# Altium project PS_PWR_UNIT.PrjPcb
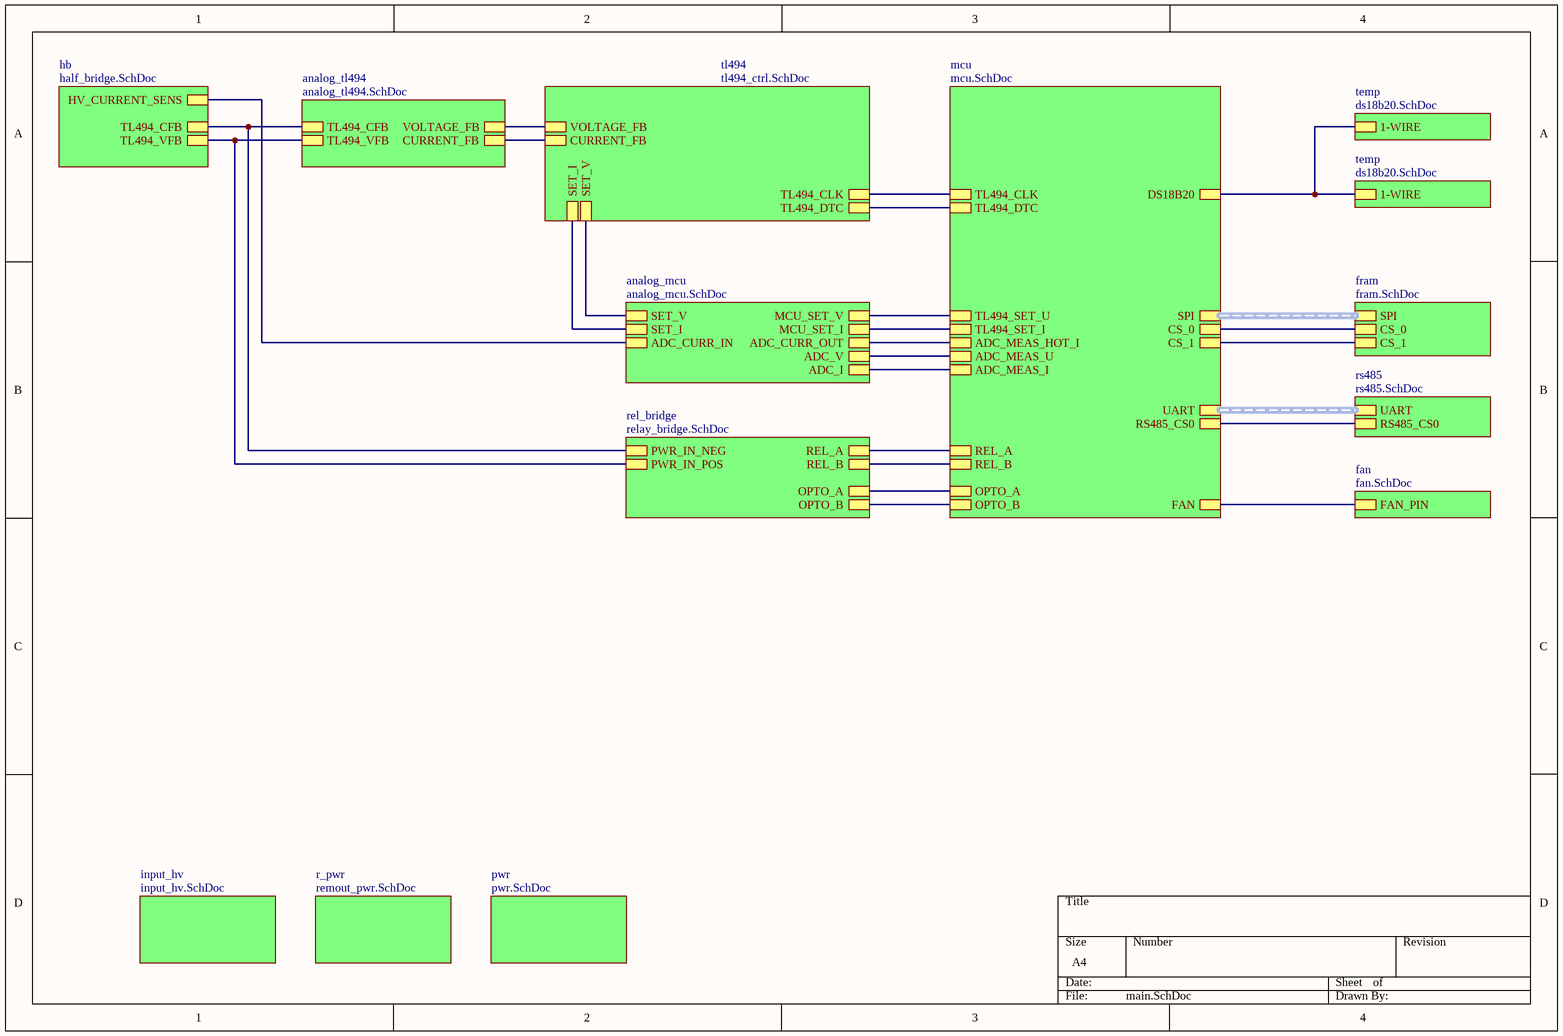
[diagram p0: main.SchDoc]
14 sheets, 287 parts. Net scope: hierarchical (ports join the sheet entries above them; power ports are global).
Board file: pwr_unit_v1.0.PcbDoc
Sheets:
  main.SchDoc
    mcu = mcu.SchDoc
    input_hv = input_hv.SchDoc
    hb = half_bridge.SchDoc
    tl494 = tl494_ctrl.SchDoc
    pwr = pwr.SchDoc
    r_pwr = remout_pwr.SchDoc
    fram = fram.SchDoc
    fan = fan.SchDoc
    rel_bridge = relay_bridge.SchDoc
    analog_tl494 = analog_tl494.SchDoc
    analog_mcu = analog_mcu.SchDoc
    rs485 = rs485.SchDoc
    temp = ds18b20.SchDoc
    temp = ds18b20.SchDoc

## Sheet main.SchDoc
size A4; SheetNumber: 1; SheetTotal: 14

### Sub-sheets
analog_mcu = analog_mcu.SchDoc: MCU_SET_V, MCU_SET_I, SET_V, SET_I, ADC_I, ADC_V, ADC_CURR_OUT, ADC_CURR_IN
analog_tl494 = analog_tl494.SchDoc: TL494_CFB, CURRENT_FB, VOLTAGE_FB, TL494_VFB
fan = fan.SchDoc: FAN_PIN
fram = fram.SchDoc: SPI (harness SPI), CS_0, CS_1
hb = half_bridge.SchDoc: TL494_VFB, TL494_CFB, HV_CURRENT_SENS
input_hv = input_hv.SchDoc: no entries
mcu = mcu.SchDoc: CS_0, CS_1, REL_B, FAN, OPTO_B, TL494_SET_U, DS18B20, SPI (harness SPI), OPTO_A, TL494_CLK, TL494_DTC, ADC_MEAS_HOT_I, RS485_CS0, REL_A, TL494_SET_I, UART (harness UART), ADC_MEAS_U, ADC_MEAS_I
pwr = pwr.SchDoc: no entries
r_pwr = remout_pwr.SchDoc: no entries
rel_bridge = relay_bridge.SchDoc: PWR_IN_NEG, PWR_IN_POS, OPTO_A, OPTO_B, REL_A, REL_B
rs485 = rs485.SchDoc: UART (harness UART), RS485_CS0
temp = ds18b20.SchDoc: 1-WIRE
temp = ds18b20.SchDoc: 1-WIRE
tl494 = tl494_ctrl.SchDoc: VOLTAGE_FB, TL494_DTC, TL494_CLK, CURRENT_FB, SET_I, SET_V

### Nets
CS: sheet mcu/RS485_CS0, sheet rs485/RS485_CS0
CS0: sheet mcu/CS_0, sheet fram/CS_0
CS1: sheet mcu/CS_1, sheet fram/CS_1
CurrentSensOut: sheet hb/HV_CURRENT_SENS, sheet analog_mcu/ADC_CURR_IN
PA0: sheet mcu/ADC_MEAS_U, sheet analog_mcu/ADC_V
PA1: sheet mcu/ADC_MEAS_I, sheet analog_mcu/ADC_I
PA2: sheet mcu/ADC_MEAS_HOT_I, sheet analog_mcu/ADC_CURR_OUT
PA6: sheet mcu/TL494_SET_I, sheet analog_mcu/MCU_SET_I
PA7: sheet mcu/TL494_SET_U, sheet analog_mcu/MCU_SET_V
PA10: sheet mcu/REL_A, sheet rel_bridge/REL_A
PA11: sheet mcu/OPTO_B, sheet rel_bridge/OPTO_B
PA12: sheet mcu/OPTO_A, sheet rel_bridge/OPTO_A
PB6: sheet mcu/DS18B20, sheet temp/1-WIRE, sheet temp/1-WIRE
PB13: sheet mcu/TL494_CLK, sheet tl494/TL494_CLK
PB14: sheet mcu/TL494_DTC, sheet tl494/TL494_DTC
PB15: sheet mcu/FAN, sheet fan/FAN_PIN
PC7: sheet mcu/REL_B, sheet rel_bridge/REL_B
TL494_CURRENT_FB: sheet hb/TL494_CFB, sheet rel_bridge/PWR_IN_NEG, sheet analog_tl494/TL494_CFB
NetC18_1: sheet hb/TL494_VFB, sheet rel_bridge/PWR_IN_POS, sheet analog_tl494/TL494_VFB
NetC52_1: sheet tl494/SET_I, sheet analog_mcu/SET_I
NetC57_1: sheet tl494/SET_V, sheet analog_mcu/SET_V
NetR77_2: sheet tl494/VOLTAGE_FB, sheet analog_tl494/VOLTAGE_FB
NetR81_2: sheet tl494/CURRENT_FB, sheet analog_tl494/CURRENT_FB

### Buses and harness runs
harness sheet fram/SPI = sheet mcu/SPI
harness sheet mcu/UART = sheet rs485/UART

## Sheet mcu.SchDoc
size A4; SheetNumber: 9; SheetTotal: 14
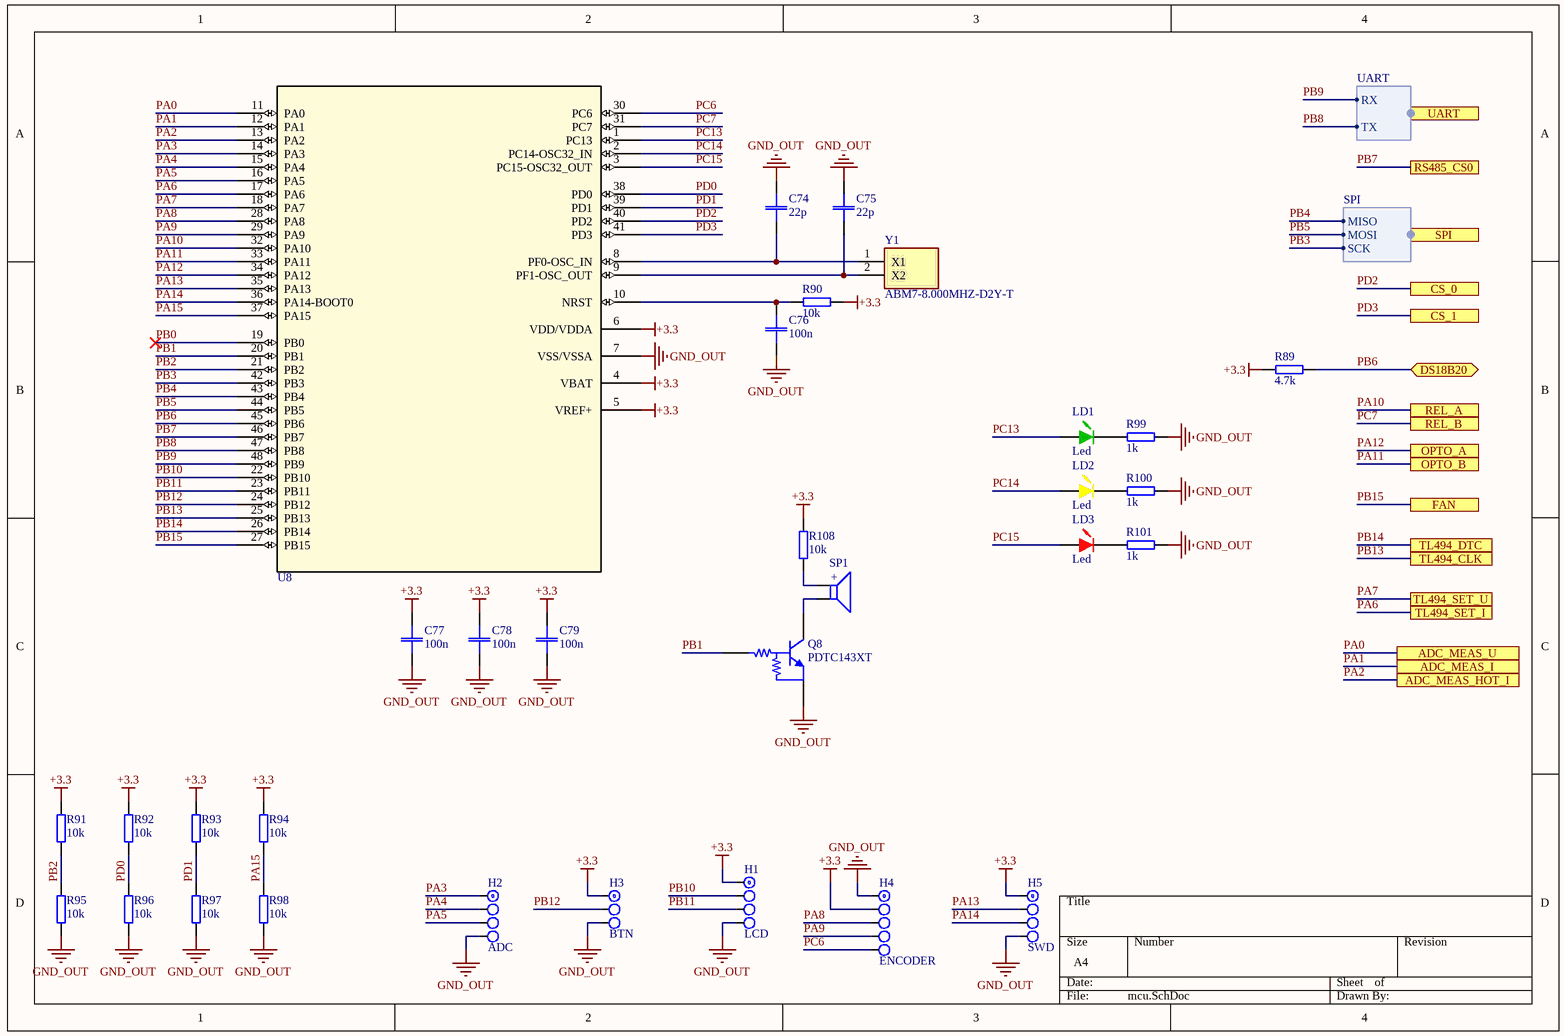
[diagram p1: mcu.SchDoc]

### Parts
C74  22p  [CAP: 0603]
C75  22p  [CAP: 0603]
C76  100n  [CAP: 0603]
C77  100n  [CAP: 0603]
C78  100n  [CAP: 0603]
C79  100n  [CAP: 0603]
H1  LCD  [J1x4]
H2  ADC  [J1x4]
H3  BTN  [J1x3]
H4  ENCODER  [J1x5]
H5  SWD  [J1x4]
LD1  Led  [Led 0805-Green]
LD2  Led  [Led 0805-Yellow]
LD3  Led  [Led 0805-Red]
Q8  PDTC143XT  [SOT23_N]
R89  4.7k  [RES: 0603]
R90  10k  [RES: 0603]
R91  10k  [RES: 0603]
R92  10k  [RES: 0603]
R93  10k  [RES: 0603]
R94  10k  [RES: 0603]
R95  10k  [RES: 0603]
R96  10k  [RES: 0603]
R97  10k  [RES: 0603]
R98  10k  [RES: 0603]
R99  1k  [RES: 0603]
R100  1k  [RES: 0603]
R101  1k  [RES: 0603]
R108  10k  [RES: 0603]
SP1  (no value)  [BUZ: D12mm  P7.6mm]
U8  STM32G070CBTx  [48-LQFP]  (value not drawn)
Y1  ABM7-8.000MHZ-D2Y-T  [ABM78000MHZD2YT]

### Ports
ADC_MEAS_HOT_I, ADC_MEAS_I, ADC_MEAS_U, CS_0, CS_1, DS18B20 (bidir), FAN, OPTO_A, OPTO_B, REL_A, REL_B, RS485_CS0, SPI (harness SPI), TL494_CLK, TL494_DTC, TL494_SET_I, TL494_SET_U, UART (harness UART)

### Harnesses
UART: RX, TX
SPI: MISO, SCK, MOSI

### Nets
+3.3: C77.2 C78.2 C79.2 H1.1 H3.1 H4.2 H5.1 R89.1 R90.2 R91.1 R92.1 R93.1 R94.1 R108.1 U8.4(VBAT) U8.5(VREF+) U8.6(VDD/VDDA)
GND_OUT: C74.2 C75.2 C76.1 C77.1 C78.1 C79.1 H1.4 H2.4 H3.3 H4.1 H5.4 Q8.2(E) R95.2 R96.2 R97.2 R98.2 R99.2 R100.2 R101.2 U8.7(VSS/VSSA)
PA0: U8.11(PA0) ; port ADC_MEAS_U
PA1: U8.12(PA1) ; port ADC_MEAS_I
PA2: U8.13(PA2) ; port ADC_MEAS_HOT_I
PA3: H2.1 U8.14(PA3)
PA4: H2.2 U8.15(PA4)
PA5: H2.3 U8.16(PA5)
PA6: U8.17(PA6) ; port TL494_SET_I
PA7: U8.18(PA7) ; port TL494_SET_U
PA8: H4.3 U8.28(PA8)
PA9: H4.4 U8.29(PA9)
PA10: U8.32(PA10) ; port REL_A
PA11: U8.33(PA11) ; port OPTO_B
PA12: U8.34(PA12) ; port OPTO_A
PA13: H5.2 U8.35(PA13)
PA14: H5.3 U8.36(PA14-BOOT0)
PA15: R94.2 R98.1 U8.37(PA15)
PB0: U8.19(PB0)
PB1: Q8.1(B) U8.20(PB1)
PB2: R91.2 R95.1 U8.21(PB2)
PB3: U8.42(PB3) ; port SPI.SCK  [project net CLK]
PB4: U8.43(PB4) ; port SPI.MISO  [project net MISO]
PB5: U8.44(PB5) ; port SPI.MOSI  [project net MOSI]
PB6: R89.2 U8.45(PB6) ; port DS18B20
PB7: U8.46(PB7) ; port RS485_CS0  [project net CS]
PB8: U8.47(PB8) ; port UART.TX
PB9: U8.48(PB9) ; port UART.RX
PB10: H1.2 U8.22(PB10)
PB11: H1.3 U8.23(PB11)
PB12: H3.2 U8.24(PB12)
PB13: U8.25(PB13) ; port TL494_CLK
PB14: U8.26(PB14) ; port TL494_DTC
PB15: U8.27(PB15) ; port FAN
PC6: H4.5 U8.30(PC6)
PC7: U8.31(PC7) ; port REL_B
PC13: LD1.1(A) U8.1(PC13)
PC14: LD2.1(A) U8.2(PC14-OSC32_IN)
PC15: LD3.1(A) U8.3(PC15-OSC32_OUT)
PD0: R92.2 R96.1 U8.38(PD0)
PD1: R93.2 R97.1 U8.39(PD1)
PD2: U8.40(PD2) ; port CS_0  [project net CS0]
PD3: U8.41(PD3) ; port CS_1  [project net CS1]
NetC74_1: C74.1 U8.8(PF0-OSC_IN) Y1.1(X1)
NetC75_1: C75.1 U8.9(PF1-OSC_OUT) Y1.2(X2)
NetC76_2: C76.2 R90.1 U8.10(NRST)
NetLD1_2: LD1.2(K) R99.1
NetLD2_2: LD2.2(K) R100.1
NetLD3_2: LD3.2(K) R101.1
NetQ8_3: Q8.3(C) SP1.2
NetR108_2: R108.2 SP1.1

### Notes on the sheet
- (in symbol BUZZER) +

### Library data of the parts
C74-C79 = C_SMD
  C74 C75: Value: 22p
  C76-C79: Value: 100n
H1 H2 H5 = H-1x4: Price: 0.04
H3 = H-1x3: Price: 0.03
H4 = H-1x5: Price: 0.05
LD1 = Led 0805 KP-2012SGC: Green 565nm 15mcd; Price: 0.09
LD2 = Led 0805 KP-2012YC: Yellow 590nm 8mcd; Price: 0.09
LD3 = Led 0805 KP-2012EC: Red  627nm 12mcd; Price: 0.09
Q8 = PDTC143XT: NPN Resistor-equipped Transistor; Published: 17-Sep-2003; LatestRevisionDate: 12-Dec-2006; LatestRevisionNote: IPC-7351 Footprint Added.; DatasheetVersion: 20-Apr-1999; PackageVersion: May-1999; PackageReference: SOT23; Publisher: Altium Limited; PackageDescription: 3-Pin SOT-23 Package 0.95 mm Pitch, 2.3 mm Lead Span; ComponentLink1Description: Manufacturer Link; ComponentLink1URL: http://www.semiconductors.philips.com/; ComponentLink2Description: Datasheet; ComponentLink2URL: http://www.semiconductors.philips.com/acrobat/datasheets/PDTC143X_SERIES_8.pdf
R89-R101 R108 = R_SMD
  R89: Value: 4.7k
  R90-R98 R108: Value: 10k
  R99-R101: Value: 1k
SP1 = BUZZER
U8 = STM32G070CBTx: The STM32G070CB/KB/RB mainstream microcontrollers are based on high-performance Arm® Cortex®-M0+ 32-bit RISC core operating at up to 64 MHz frequency. / 128 Kbytes of Flash program memory and 36 Kbytes of SRAM. With 48pin LQFP 7x7x1.4 package; Manufacturer_Part_Number: stm32g0_lqfp48_t2; Vendor: STMicroelectronics; Copyright: Copyright (C) 2018 Accelerated Designs. All rights reserved; RefDes: RefDes; Type: DEV; Value: Value
Y1 = ABM7-8.000MHZ-D2Y-T: Crystal or Oscillator; Manufacturer_Name: ABRACON; Datasheet Link: http://www.abracon.com/Resonators/abm7.pdf; Height: 1.4mm; Manufacturer_Part_Number: ABM7-8.000MHZ-D2Y-T; Mouser Part Number: 815-ABM7-8-D2Y-T; Mouser Price/Stock: https://www.mouser.co.uk/ProductDetail/ABRACON/ABM7-8000MHZ-D2Y-T?qs=LoTOQoUkC8SFsmY8snleBA%3D%3D; Arrow Part Number: ABM7-8.000MHZ-D2Y-T; Arrow Price/Stock: https://www.arrow.com/en/products/abm7-8.000mhz-d2y-t/abracon?region=nac

## Sheet input_hv.SchDoc
size A4; SheetNumber: 2; SheetTotal: 14
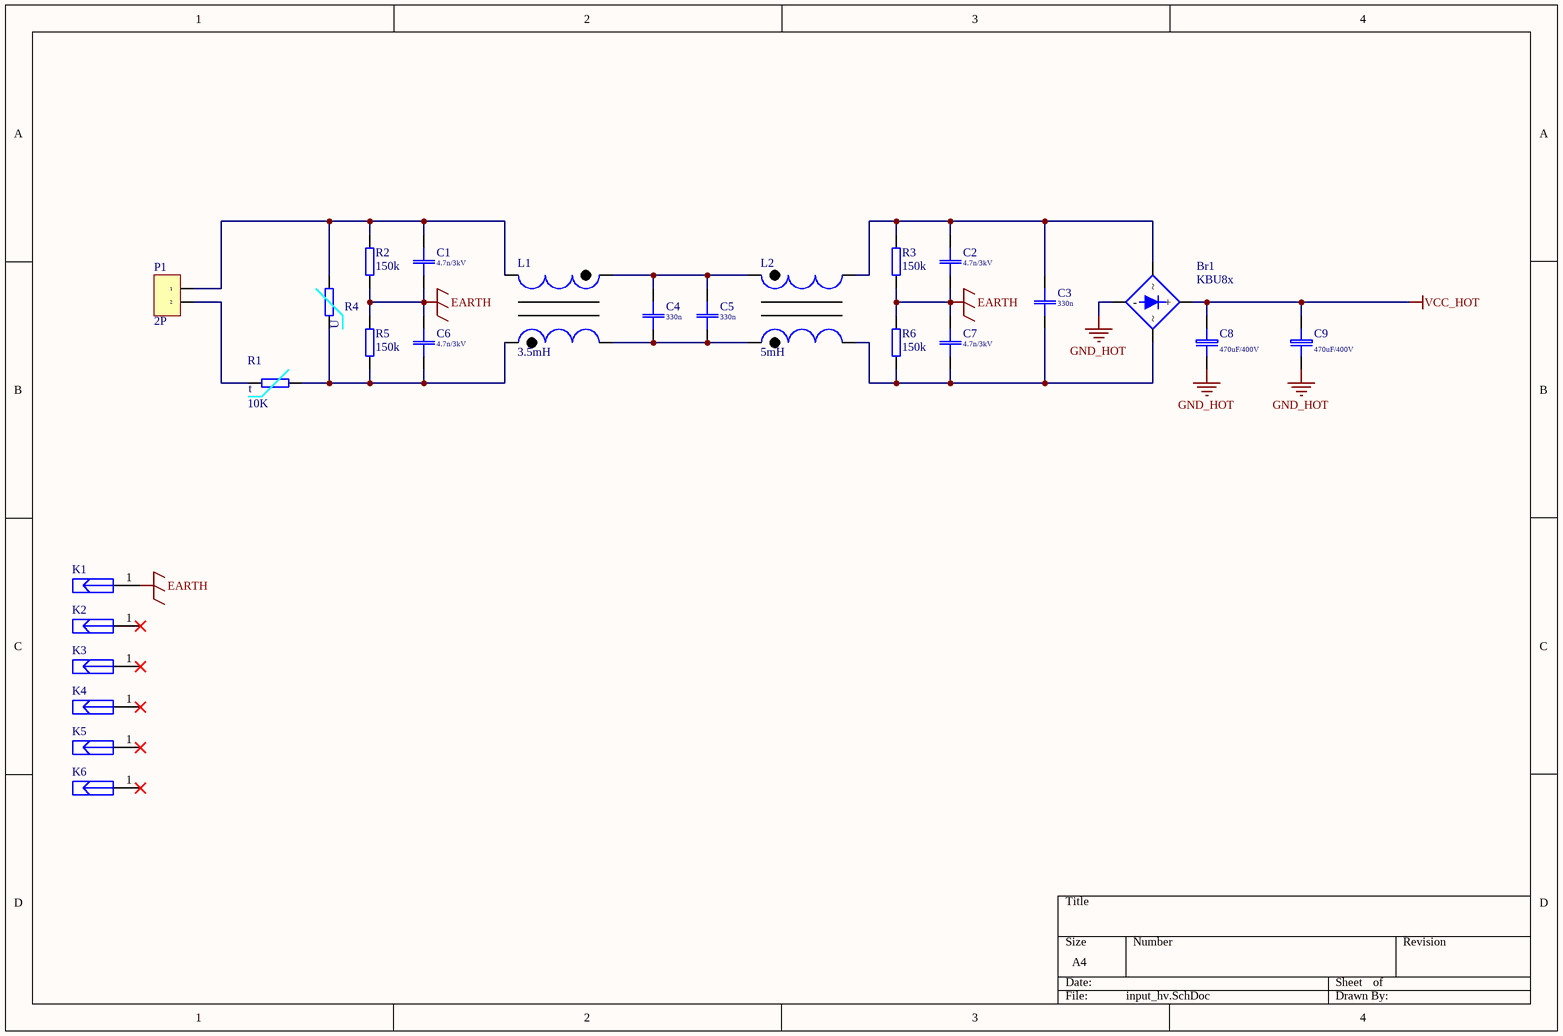
[diagram p2: input_hv.SchDoc]

### Parts
Br1  KBU8x  [KBU-200 h22mm]
C1  4.7n/3kV  [Cer-Disk-D8-R7.62]
C2  4.7n/3kV  [Cer-Disk-D8-R7.62]
C3  330n  [MKP X2 100nF 275V AC]
C4  330n  [MKP X2 100nF 275V AC]
C5  330n  [MKP X2 100nF 275V AC]
C6  4.7n/3kV  [Cer-Disk-D8-R7.62]
C7  4.7n/3kV  [Cer-Disk-D8-R7.62]
C8  470uF/400V  [CAP: D25C10H50]
C9  470uF/400V  [CAP: D25C10H50]
K1  (no value)  [CON: TH 3.5mm]
K2  (no value)  [CON: TH 3.5mm]
K3  (no value)  [CON: TH 3.5mm]
K4  (no value)  [CON: TH 3.5mm]
K5  (no value)  [CON: TH 3.5mm]
K6  (no value)  [CON: TH 3.5mm]
L1  3.5mH  [IND: R26.9/14.7/11.2 (H)]
L2  5mH  [IND: R26.9/14.7/11.2 (H)]
P1  2P  [CON: 2P V 3.5mm]
R1  10K  [RES: NTC D15-R7.62]
R2  150k  [RES: 0.125W H]
R3  150k  [RES: 0.125W H]
R4  VAR  [RES: VAR 11K 300]  (value not drawn)
R5  150k  [RES: 0.125W H]
R6  150k  [RES: 0.125W H]

### Nets
EARTH: C1.2 C2.2 C6.1 C7.1 K1.1 R2.2 R3.2 R5.1 R6.1
GND_HOT: Br1.2(-) C8.2(-) C9.2(-)
VCC_HOT: Br1.1(+) C8.1(+) C9.1(+)
NetBr1_3: Br1.3 C3.2 C7.2 L2.4 R6.2
NetBr1_4: Br1.4 C2.1 C3.1 L2.2 R3.1
NetC1_1: C1.1 L1.1 P1.1 R2.1 R4.2
NetC4_1: C4.1 C5.1 L1.2 L2.1
NetC4_2: C4.2 C5.2 L1.4 L2.3
NetC6_2: C6.2 L1.3 R1.2 R4.1 R5.2
NetP1_2: P1.2 R1.1

Not connected (* = marked no-connect by the designer): K2 1*; K3 1*; K4 1*; K5 1*; K6 1*

### Notes on the sheet
- (in symbol R_NTC) t
- (in symbol R_VAR) U

### Library data of the parts
Br1 = KBU: Грец  8A; Price: 0.52
C1 C2 C6 C7 = Cer Disc HV 2.2n 2kV: 2.2n 2kV Y5P; Tip: Suntan TS16 2.2nF 2kV Y5P; Price: 0.072; Value: 4.7n/3kV
C3-C5 = X2 100n 275V AC: X2 250V AC; Price: 0.15; Value: 330n
C8 C9 = C_EL: Value: 470uF/400V
K1-K6 = PCB CON
L1 = DROSSEL_1: Value: 3.5mH
L2 = DROSSEL: Value: 5mH
R1 = R_NTC: Value: 10K
R2 R3 R5 R6 = R_DIP: Value: 150k
R4 = R_VAR: Value: VAR
P1 = 2P: Value: 2P

## Sheet half_bridge.SchDoc
size A4; SheetNumber: 3; SheetTotal: 14
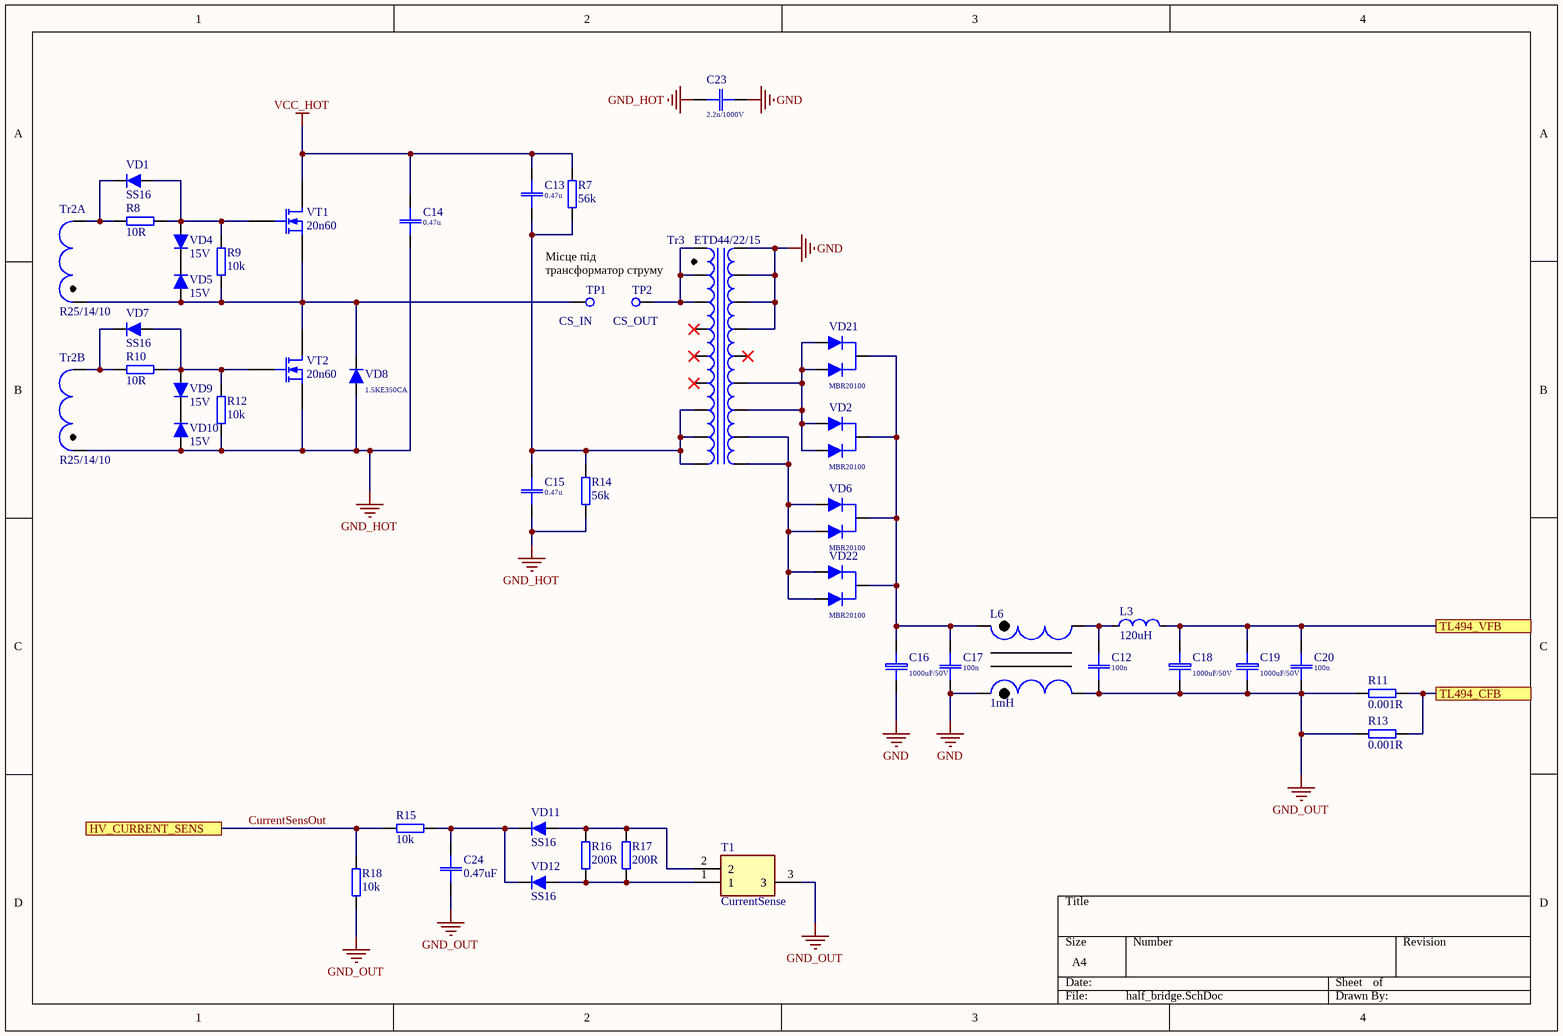
[diagram p3: half_bridge.SchDoc]

### Parts
C12  100n  [MKP X2 100nF 275V AC]
C13  0.47u  [MKP 31.5x11 h21 R27.5]
C14  0.47u  [MKP 31.5x11 h21 R27.5]
C15  0.47u  [MKP 31.5x11 h21 R27.5]
C16  1000uF/50V  [CAP: D16C7.5H25]
C17  100n  [MKP X2 100nF 275V AC]
C18  1000uF/50V  [CAP: D16C7.5H25]
C19  1000uF/50V  [CAP: D16C7.5H25]
C20  100n  [MKP X2 100nF 275V AC]
C23  2.2n/1000V  [MKP 26.5x7 h14 R22.5]
C24  0.47uF  [CAP: 0603]
L3  120uH  [IND: R39.9/24.1/14.5 (H)]
L6  1mH  [IND: R39.9/24.1/14.5 (H)]
R7  56k  [RES: 2W H]
R8  10R  [RES: 0805]
R9  10k  [RES: 0805]
R10  10R  [RES: 0805]
R11  0.001R  [RES: 2512]
R12  10k  [RES: 0805]
R13  0.001R  [RES: 2512]
R14  56k  [RES: 2W H]
R15  10k  [RES: 0603]
R16  200R  [RES: 0805]
R17  200R  [RES: 0805]
R18  10k  [RES: 0603]
T1  CurrentSense  [AC1015]
TP1  CS_IN  [TP: TEST POINT DIP]
TP2  CS_OUT  [TP: TEST POINT DIP]
Tr2  R25/14/10  [IND: R26.9/14.7/11.2 (H)]  (parts A,B of 2)
Tr3  ETD44/22/15  [TRANS: ETD44/22/15]
VD1  SS16  [DIODE: SMA]
VD2  MBR20100  [DO220D-RB-600]
VD4  15V  [DIODE: SMA]
VD5  15V  [DIODE: SMA]
VD6  MBR20100  [DO220D-RB-600]
VD7  SS16  [DIODE: SMA]
VD8  1.5KE350CA  [DO-201-500]
VD9  15V  [DIODE: SMA]
VD10  15V  [DIODE: SMA]
VD11  SS16  [DIODE: SOD123]
VD12  SS16  [DIODE: SOD123]
VD21  MBR20100  [DO220D-RB-600]
VD22  MBR20100  [DO220D-RB-600]
VT1  20n60  [TO247(H)]
VT2  20n60  [TO247(H)]

### Ports
HV_CURRENT_SENS, TL494_CFB, TL494_VFB

### Nets
GND: C16.2(-) C17.2 C23.2 L6.1 Tr3.15 Tr3.16 Tr3.17 Tr3.18
GND_HOT: C14.2 C15.2 C23.1 R12.2 R14.2 Tr2.3 VD8.1(A) VD10.1(A) VT2.3(S)
GND_OUT: C12.2 C18.2(-) C19.2(-) C20.2 C24.1 L6.2 R11.2 R13.2 R18.2 T1.3
VCC_HOT: C13.1 C14.1 R7.1 VT1.2(D)
CurrentSensOut: R15.2 R18.1 ; port HV_CURRENT_SENS
TL494_CURRENT_FB: R11.1 R13.1 ; port TL494_CFB
NetC12_1: C12.1 L3.1 L6.4
NetC13_2: C13.2 C15.1 R7.2 R14.1 Tr3.7 Tr3.8 Tr3.9
NetC16_1: C16.1(+) C17.1 L6.3 VD2.2(C) VD6.2(C) VD21.2(C) VD22.2(C)
NetC18_1: C18.1(+) C19.1(+) C20.1 L3.2 ; port TL494_VFB
NetC24_2: C24.2 R15.1 VD11.2(C) VD12.2(C)
NetR8_1: R8.1 R9.1 VD1.1(A) VD4.1(A) VT1.1(G)
NetR8_2: R8.2 Tr2.2 VD1.2(C)
NetR9_2: R9.2 TP1.1 Tr2.1 VD5.1(A) VD8.2(C) VT1.3(S) VT2.2(D)
NetR10_1: R10.1 R12.1 VD7.1(A) VD9.1(A) VT2.1(G)
NetR10_2: R10.2 Tr2.4 VD7.2(C)
NetR16_1: R16.1 R17.1 T1.2 VD11.1(A)
NetR16_2: R16.2 R17.2 T1.1 VD12.1(A)
NetTP2_1: TP2.1 Tr3.1 Tr3.2 Tr3.3
NetTr3_10: Tr3.10 Tr3.11 VD6.1(A) VD6.3(A) VD22.1(A) VD22.3(A)
NetTr3_12: Tr3.12 Tr3.13 VD2.1(A) VD2.3(A) VD21.1(A) VD21.3(A)
NetVD4_2: VD4.2(C) VD5.2(C)
NetVD9_2: VD9.2(C) VD10.2(C)

Not connected (* = marked no-connect by the designer): Tr3 4* 5* 6* 14*

### Notes on the sheet
- Місце під трансформатор струму

### Library data of the parts
C12 C17 C20 = X2 100n 275V AC: X2 250V AC; Price: 0.15; Value: 100n
C13-C15 = MKP10 0.47u 400V AC: Price: 1.43; Value: 0.47u
C16 C18 C19 = C_EL: Value: 1000uF/50V
C23 = MKP10 0.68u 400V AC: Value: 2.2n/1000V
C24 = C_SMD: Value: 0.47uF
L3 = L_DIP: Value: 120uH
L6 = DROSSEL: Value: 1mH
R7 R14 = R_DIP: Value: 56k
R8-R13 R15-R18 = R_SMD
  R8 R10: Value: 10R
  R9 R12 R15 R18: Value: 10k
  R11 R13: Value: 0.001R
  R16 R17: Value: 200R
T1 = AC-1020: Transformer; Manufacturer_Name: Nuvotem Talema; Height: 23mm; Manufacturer_Part_Number: AC-1020
TP1 TP2 = TEST POINT
  TP1: Value: CS_IN
  TP2: Value: CS_OUT
Tr2 = HulfBribge_Secondary: Value: R25/14/10
VD1 VD4 VD5 VD7 VD9-VD12 = DIODE_SMD
  VD1 VD7 VD11 VD12: Value: SS16
  VD4 VD5 VD9 VD10: Value: 15V
VD2 VD6 VD21 VD22 = DIODE_DIP_1: Value: MBR20100
VD8 = DIODE_DIP: Value: 1.5KE350CA
VT1 VT2 = MOSFET N_1: Value: 20n60
Tr3 = ETD44/22/15: Value: ETD44/22/15

## Sheet tl494_ctrl.SchDoc
size A4; SheetNumber: 11; SheetTotal: 14
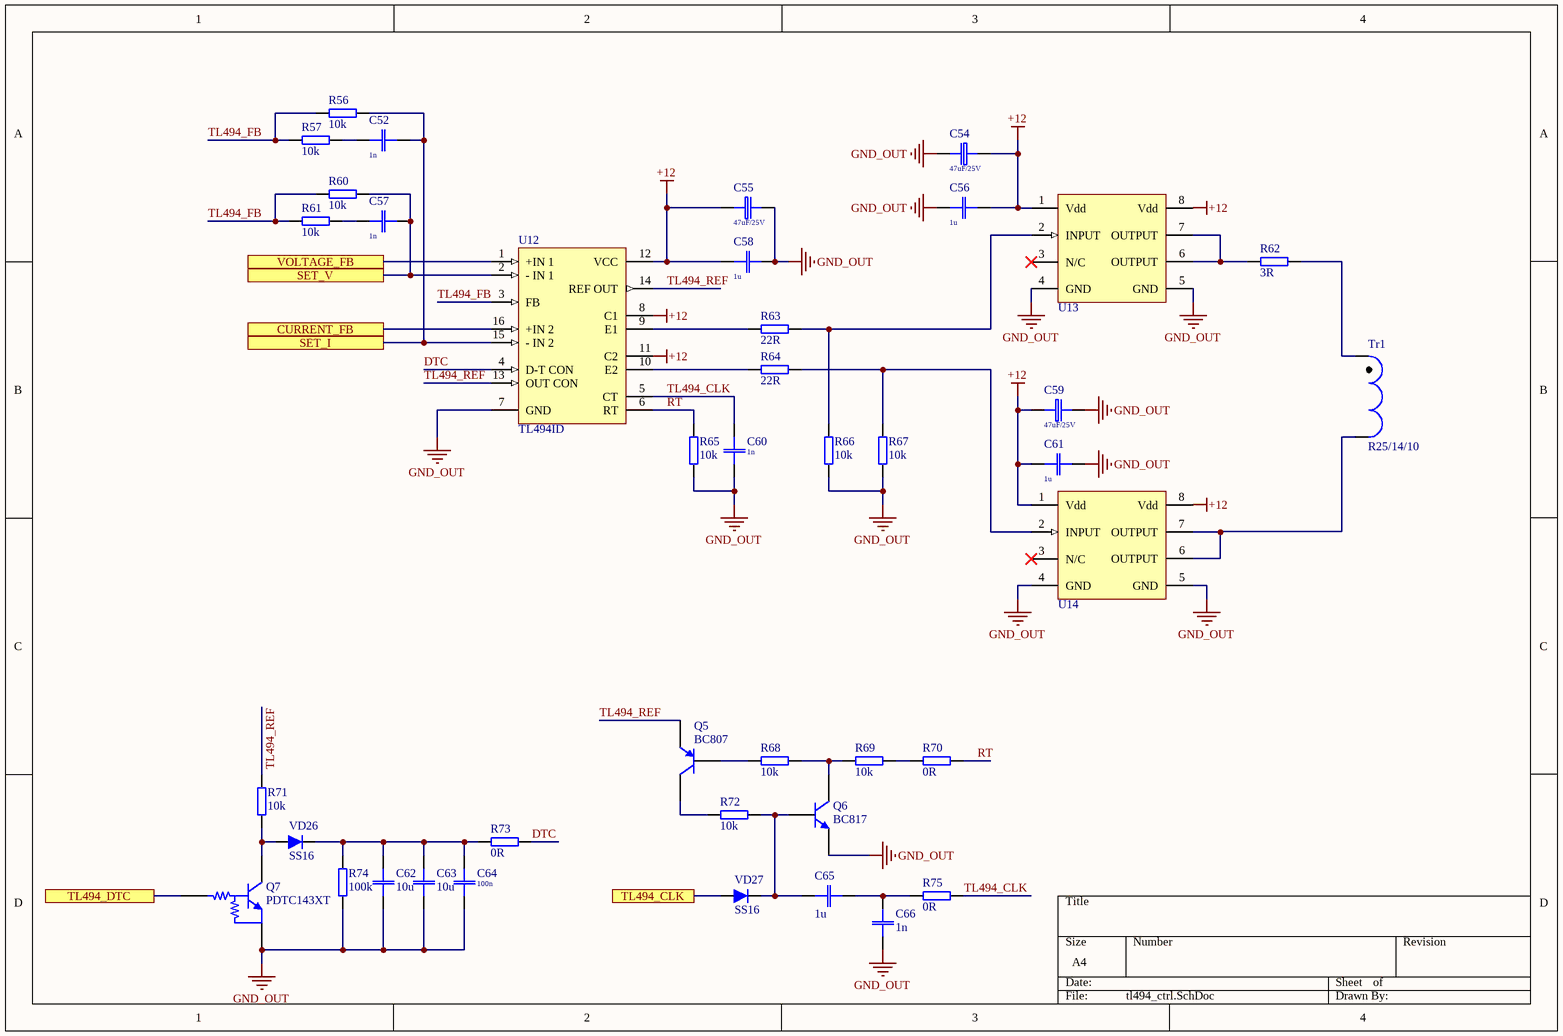
[diagram p4: tl494_ctrl.SchDoc]

### Parts
C52  1n  [C0603]
C54  47uF/25V  [EL Case C (6032-28)]
C55  47uF/25V  [EL Case C (6032-28)]
C56  1u  [C1206(3216)]
C57  1n  [C0603]
C58  1u  [C1206(3216)]
C59  47uF/25V  [EL Case C (6032-28)]
C60  1n  [C0603]
C61  1u  [C1206(3216)]
C62  10u  [CAP: 0805]
C63  10u  [CAP: 0805]
C64  100n  [C0603]
C65  1u  [CAP: 0805]
C66  1n  [CAP: 0805]
Q5  BC807  [SOT23_N]
Q6  BC817  [SOT23_N]
Q7  PDTC143XT  [SOT23_N]
R56  10k  [RES: 0603]
R57  10k  [RES: 0603]
R60  10k  [RES: 0603]
R61  10k  [RES: 0603]
R62  3R  [RES: 1206]
R63  22R  [RES: 0603]
R64  22R  [RES: 0603]
R65  10k  [RES: 0603]
R66  10k  [RES: 0603]
R67  10k  [RES: 0603]
R68  10k  [RES: 0603]
R69  10k  [RES: 0603]
R70  0R  [RES: 0603]
R71  10k  [RES: 0603]
R72  10k  [RES: 0603]
R73  0R  [RES: 0603]
R74  100k  [RES: 0603]
R75  0R  [RES: 0603]
Tr1  R25/14/10  [IND: PRIMARY_SIDE_HB_B]
U12  TL494ID  [D016_N]
U13  TC4420  [8-SOIC]  (value not drawn)
U14  TC4420  [8-SOIC]  (value not drawn)
VD26  SS16  [DIODE: SOD123]
VD27  SS16  [DIODE: SOD123]

### Ports
CURRENT_FB, SET_I, SET_V, TL494_CLK, TL494_DTC, VOLTAGE_FB

### Nets
+12: C54.1(+) C55.1(+) C56.1 C58.1 C59.1(+) C61.1 U12.8(C1) U12.11(C2) U12.12(VCC) U13.1(Vdd) U13.8(Vdd) U14.1(Vdd) U14.8(Vdd)  [project net FB_+12]
GND_OUT: C54.2(-) C55.2(-) C56.2 C58.2 C59.2(-) C60.1 C61.2 C62.1 C63.1 C64.1 C66.2 Q6.2(E) Q7.2(E) R65.2 R66.2 R67.2 R74.1 U12.7(GND) U13.4(GND) U13.5(GND) U14.4(GND) U14.5(GND)
DTC: R73.1 U12.4(D-T_CON)
PB13: VD27.1(A) ; port TL494_CLK
PB14: Q7.1(B) ; port TL494_DTC
RT: R65.1 R70.2 U12.6(RT)
TL494_CLK: C60.2 R75.2 U12.5(CT)
TL494_FB: R56.1 R57.1 R60.1 R61.1 U12.3(FB)
TL494_REF: Q5.2(E) R71.1 U12.13(OUT_CON) U12.14(REF_OUT)
NetC52_1: C52.1 R56.2 U12.15(-_IN_2) ; port SET_I
NetC52_2: C52.2 R57.2
NetC57_1: C57.1 R60.2 U12.2(-_IN_1) ; port SET_V
NetC57_2: C57.2 R61.2
NetC62_2: C62.2 C63.2 C64.2 R73.2 R74.2 VD26.2(C)
NetC65_1: C65.1 C66.1 R75.1
NetC65_2: C65.2 Q6.1(B) R72.2 VD27.2(C)
NetQ5_1: Q5.1(B) R68.1
NetQ5_3: Q5.3(C) R72.1
NetQ6_3: Q6.3(C) R68.2 R69.1
NetQ7_3: Q7.3(C) R71.2 VD26.1(A)
NetR62_1: R62.1 U13.6(OUTPUT) U13.7(OUTPUT)
NetR62_2: R62.2 Tr1.1
NetR63_1: R63.1 U12.9(E1)
NetR63_2: R63.2 R66.1 U13.2(INPUT)
NetR64_1: R64.1 U12.10(E2)
NetR64_2: R64.2 R67.1 U14.2(INPUT)
NetR69_2: R69.2 R70.1
NetR77_2: U12.1(+IN_1) ; port VOLTAGE_FB
NetR81_2: U12.16(+IN_2) ; port CURRENT_FB
NetTr1_2: Tr1.2 U14.6(OUTPUT) U14.7(OUTPUT)

Not connected (* = marked no-connect by the designer): U13 3(N/C)*; U14 3(N/C)*

### Library data of the parts
C52 C57 C60 C64 = C-0603: SMD-0603; Price: 0.014
  C52 C57 C60: Value: 1n
  C64: Value: 100n
C54 C55 C59 = EL Case C (6032-28): EL Tantalum Case C (6032-28); Price: 0.41; Value: 47uF/25V
C56 C58 C61 = C-1206  100V 1u: SMD-1206 100V X7R 10%; Price: 0.085; Value: 1u
C62 C63 C65 C66 = C_SMD
  C62 C63: Value: 10u
  C65: Value: 1u
  C66: Value: 1n
Q5 = BC807: PNP General-purpose Transistor; Published: 17-Sep-2003; LatestRevisionDate: 12-Dec-2006; LatestRevisionNote: IPC-7351 Footprint Added.; DatasheetVersion: 8-Apr-1999; PackageVersion: May-1999; PackageReference: SOT23; Publisher: Altium Limited; PackageDescription: 3-Pin SOT-23 Package 0.95 mm Pitch, 2.3 mm Lead Span; ComponentLink1Description: Manufacturer Link; ComponentLink1URL: http://www.semiconductors.philips.com/; ComponentLink2Description: Datasheet; ComponentLink2URL: http://www.semiconductors.philips.com/acrobat/datasheets/BC807_BC807W_BC327_5.pdf
Q6 = BC817: NPN General-purpose Transistor; Published: 17-Sep-2003; LatestRevisionDate: 12-Dec-2006; LatestRevisionNote: IPC-7351 Footprint Added.; DatasheetVersion: Jun-1999; PackageVersion: May-1999; PackageReference: SOT23; Publisher: Altium Limited; PackageDescription: 3-Pin SOT-23 Package 0.95 mm Pitch, 2.3 mm Lead Span; ComponentLink1Description: Manufacturer Link; ComponentLink1URL: http://www.semiconductors.philips.com/; ComponentLink2Description: Datasheet; ComponentLink2URL: http://www.semiconductors.philips.com/acrobat/datasheets/BC817_BC817W_BC337_5.pdf
Q7 = PDTC143XT: NPN Resistor-equipped Transistor; Published: 17-Sep-2003; LatestRevisionDate: 12-Dec-2006; LatestRevisionNote: IPC-7351 Footprint Added.; DatasheetVersion: 20-Apr-1999; PackageVersion: May-1999; PackageReference: SOT23; Publisher: Altium Limited; PackageDescription: 3-Pin SOT-23 Package 0.95 mm Pitch, 2.3 mm Lead Span; ComponentLink1Description: Manufacturer Link; ComponentLink1URL: http://www.semiconductors.philips.com/; ComponentLink2Description: Datasheet; ComponentLink2URL: http://www.semiconductors.philips.com/acrobat/datasheets/PDTC143X_SERIES_8.pdf
R56 R57 R60-R75 = R_SMD
  R56 R57 R60 R61 R65-R69 R71 R72: Value: 10k
  R62: Value: 3R
  R63 R64: Value: 22R
  R70 R73 R75: Value: 0R
  R74: Value: 100k
Tr1 = Primary: Value: R25/14/10
U12 = TL494ID: Pulse-Width-Modulation Control Circuit; Published: 15-Apr-2002; LatestRevisionDate: 13-Apr-2006; LatestRevisionNote: IPC-7351 Footprint Added.; DatasheetVersion: Oct-1988; PackageVersion: Jan-1998; PackageReference: D016; Publisher: Altium Limited; PackageDescription: 16-Pin Small Outline Integrated Circuit 1.27 mm Pitch; Code_IPC: SOIC127P600-16; ComponentLink1Description: Manufacturer Link; ComponentLink1URL: http://www.ti.com/
VD26 VD27 = DIODE_SMD: Value: SS16

## Sheet pwr.SchDoc
size A4; SheetNumber: 10; SheetTotal: 14
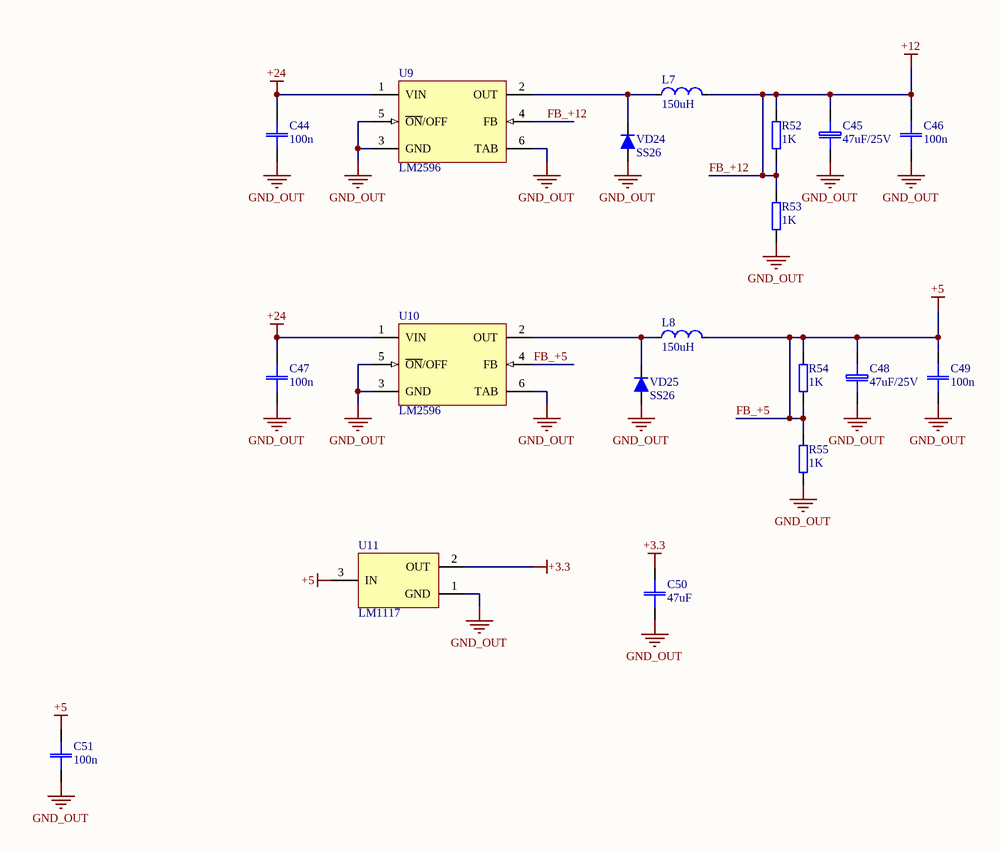
[diagram p5: pwr.SchDoc]

### Parts
C44  100n  [CAP: 1206]
C45  47uF/25V  [CAP: TANTAL-C]
C46  100n  [CAP: 0805]
C47  100n  [CAP: 1206]
C48  47uF/25V  [CAP: TANTAL-C]
C49  100n  [CAP: 0805]
C50  47uF  [CAP: 0805]
C51  100n  [CAP: 0805]
L7  150uH  [IND: SRP1265A]
L8  150uH  [IND: SRP1265A]
R52  1K  [RES: 0603]
R53  1K  [RES: 0603]
R54  1K  [RES: 0603]
R55  1K  [RES: 0603]
U9  LM2596  [POW: D2PAK-5]
U10  LM2596  [POW: D2PAK-5]
U11  LM1117  [SOT223]
VD24  SS26  [DIODE: SMA]
VD25  SS26  [DIODE: SMA]

### Nets
+3.3: C50.2 U11.2(OUT)
+24: C44.2 C47.2 U9.1(VIN) U10.1(VIN)
FB_+5: C48.1(+) C49.2 C51.2 L8.2 R54.1 R54.2 R55.1 U10.4(FB) U11.3(IN)  [also labelled +5]
FB_+12: C45.1(+) C46.2 L7.2 R52.1 R52.2 R53.1 U9.4(FB)  [also labelled +12]
GND_OUT: C44.1 C45.2(-) C46.1 C47.1 C48.2(-) C49.1 C50.1 C51.1 R53.2 R55.2 U9.3(GND) U9.5(~{ON}/OFF) U9.6(TAB) U10.3(GND) U10.5(~{ON}/OFF) U10.6(TAB) U11.1(GND) VD24.1(A) VD25.1(A)
NetL7_1: L7.1 U9.2(OUT) VD24.2(C)
NetL8_1: L8.1 U10.2(OUT) VD25.2(C)

### Library data of the parts
C44 C46 C47 C49-C51 = C_SMD
  C44 C46 C47 C49 C51: Value: 100n
  C50: Value: 47uF
C45 C48 = C_TANTAL: Value: 47uF/25V
L7 L8 = L_SMD: Value: 150uH
R52-R55 = R_SMD: Value: 1K
VD24 VD25 = DIODE_SMD: Value: SS26
U9 U10 = LM2596: Value: LM2596
U11 = LM1117: Value: LM1117

## Sheet remout_pwr.SchDoc
size A4; SheetNumber: 4; SheetTotal: 14
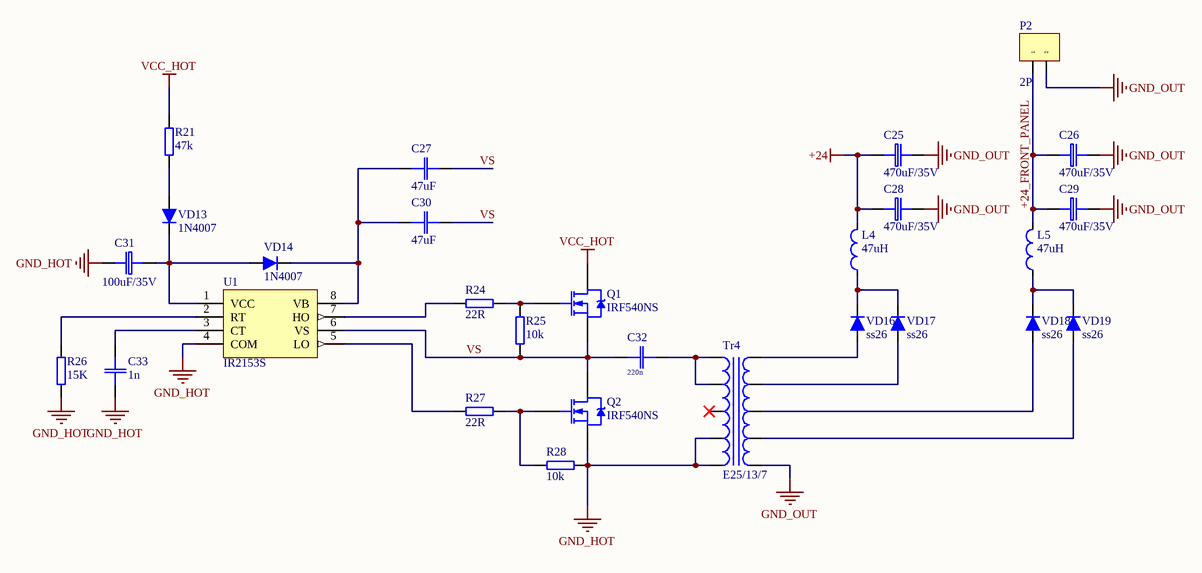
[diagram p6: remout_pwr.SchDoc]

### Parts
C25  470uF/35V  [CAP: D6.3C2.5H11]
C26  470uF/35V  [CAP: D6.3C2.5H11]
C27  47uF  [CAP: 1210]
C28  470uF/35V  [CAP: D6.3C2.5H11]
C29  470uF/35V  [CAP: D6.3C2.5H11]
C30  47uF  [CAP: 1210]
C31  100uF/35V  [CAP: D6.3C2.5H11]
C32  220n  [MKP 13x5 h11 R10]
C33  1n  [CAP: 0805]
L4  47uH  [IND: SRP1265A]
L5  47uH  [IND: SRP1265A]
P2  2P  [CON: 2P V 3.5mm]
Q1  IRF540NS  [D2PAK_N]
Q2  IRF540NS  [D2PAK_N]
R21  47k  [RES: 2W H]
R24  22R  [RES: 0805]
R25  10k  [RES: 0805]
R26  15K  [RES: 0805]
R27  22R  [RES: 0805]
R28  10k  [RES: 0805]
Tr4  E25/13/7  [TRANS: E25/13/7]
U1  IR2153S  [SO-8_N]
VD13  1N4007  [DIODE: SMA]
VD14  1N4007  [DIODE: SMA]
VD16  ss26  [DIODE: SMA]
VD17  ss26  [DIODE: SMA]
VD18  ss26  [DIODE: SMA]
VD19  ss26  [DIODE: SMA]

### Nets
+24: C25.1(+) C28.1(+) L4.2
GND_HOT: C31.2(-) C33.1 Q2.3(S) R26.2 R28.1 Tr4.4 Tr4.5 U1.4(COM)
GND_OUT: C25.2(-) C26.2(-) C28.2(-) C29.2(-) P2.2 Tr4.6
VCC_HOT: Q1.2(D) R21.1
+24_FRONT_PANEL: C26.1(+) C29.1(+) L5.2 P2.1
VS: C27.1 C30.1 C32.1 Q1.3(S) Q2.2(D) R25.1 U1.6(VS)
NetC27_2: C27.2 C30.2 U1.8(VB) VD14.2(C)
NetC31_1: C31.1(+) U1.1(VCC) VD13.2(C) VD14.1(A)
NetC32_2: C32.2 Tr4.1 Tr4.2
NetC33_2: C33.2 U1.3(CT)
NetL4_1: L4.1 VD16.2(C) VD17.2(C)
NetL5_1: L5.1 VD18.2(C) VD19.2(C)
NetQ1_1: Q1.1(G) R24.2 R25.2
NetQ2_1: Q2.1(G) R27.2 R28.2
NetR21_2: R21.2 VD13.1(A)
NetR24_1: R24.1 U1.7(HO)
NetR26_1: R26.1 U1.2(RT)
NetR27_1: R27.1 U1.5(LO)
NetTr4_7: Tr4.7 VD19.1(A)
NetTr4_8: Tr4.8 VD18.1(A)
NetTr4_9: Tr4.9 VD17.1(A)
NetTr4_10: Tr4.10 VD16.1(A)

Not connected (* = marked no-connect by the designer): Tr4 3*

### Library data of the parts
C25 C26 C28 C29 C31 = C_EL
  C25 C26 C28 C29: Value: 470uF/35V
  C31: Value: 100uF/35V
C27 C30 C33 = C_SMD
  C27 C30: Value: 47uF
  C33: Value: 1n
C32 = MKS4 68n 400V: Value: 220n
L4 L5 = L_SMD: Value: 47uH
Q1 Q2 = IRF540NS: HEXFET Power MOSFET; Published: 8-Jun-2000; LatestRevisionDate: 20-Nov-2009; LatestRevisionNote: IPC-7351 Footprint Added.; DatasheetVersion: May-1998; PackageReference: D2PAK; Publisher: Altium Limited; PackageDescription: 3-Pin Transistor Outline Package 2.54 mm Pitch, 15.1 mm Lead Span; ComponentLink1Description: Manufacturer Link; ComponentLink1URL: http://www.irf.com/; ComponentLink2Description: Datasheet; ComponentLink2URL: http://www.irf.com/product-info/datasheets/data/irf540ns.pdf
R21 = R_DIP: Value: 47k
R24-R28 = R_SMD
  R24 R27: Value: 22R
  R25 R28: Value: 10k
  R26: Value: 15K
U1 = IR2153S: Self-Oscillating Half-Bridge Driver; Published: 8-Jun-2000; LatestRevisionDate: 13-Apr-2006; LatestRevisionNote: IPC-7351 Footprint Added.; DatasheetVersion: PD60062J; PackageVersion: Feb-2001; PackageReference: SO-8; Publisher: Altium Limited; PackageDescription: 8-Pin Plastic Small Outline Integrated Circuit 1.27 mm Pitch; Code_JEDEC: MS-012-AA; Code_IPC: SOIC127P600-8; ComponentLink1Description: Manufacturer Link; ComponentLink1URL: http://www.irf.com/; ComponentLink2Description: Datasheet; ComponentLink2URL: http://www.irf.com/product-info/datasheets/data/ir2153.pdf
VD13 VD14 VD16-VD19 = DIODE_SMD
  VD13 VD14: Value: 1N4007
  VD16-VD19: Value: ss26
P2 = 2P: Value: 2P
Tr4 = E25/13/7: Value: E25/13/7

## Sheet fram.SchDoc
size A4; SheetNumber: 8; SheetTotal: 14
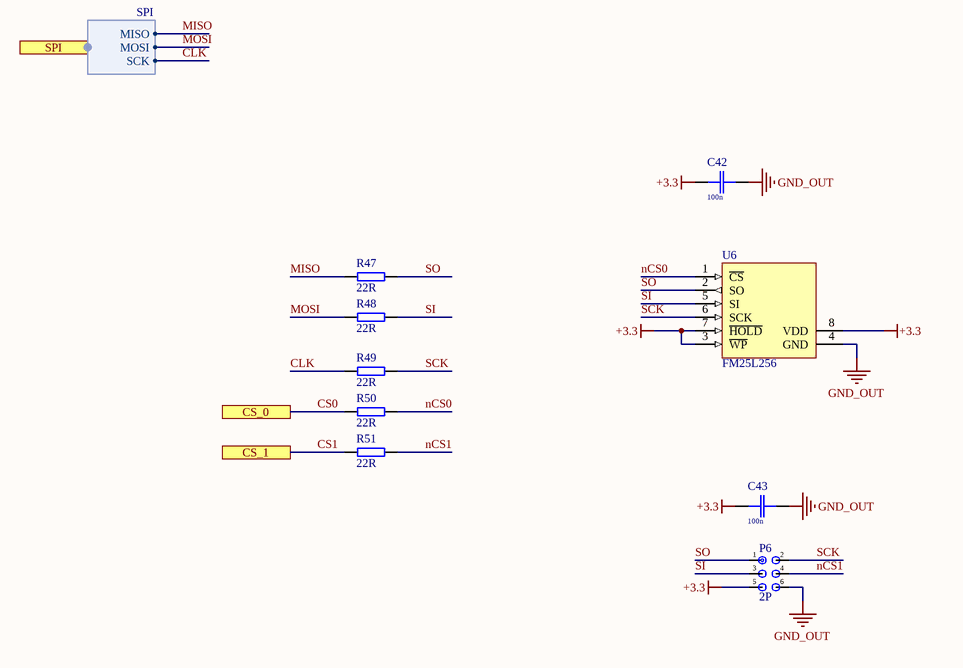
[diagram p7: fram.SchDoc]

### Parts
C42  100n  [C0603]
C43  100n  [C0603]
P6  2P  [CON: PLS-6]
R47  22R  [RES: 0603]
R48  22R  [RES: 0603]
R49  22R  [RES: 0603]
R50  22R  [RES: 0603]
R51  22R  [RES: 0603]
U6  FM25L256  [SOIC127P600X175-8M]

### Ports
CS_0, CS_1, SPI (harness SPI)

### Harnesses
SPI: MISO, SCK, MOSI

### Nets
+3.3: C42.1 C43.1 P6.5 U6.3(~{WP}) U6.7(~{HOLD}) U6.8(VDD)
GND_OUT: C42.2 C43.2 P6.6 U6.4(GND)
CLK: R49.2 ; port SPI.SCK
CS0: R50.2 ; port CS_0
CS1: R51.2 ; port CS_1
MISO: R47.2 ; port SPI.MISO
MOSI: R48.2 ; port SPI.MOSI
nCS0: R50.1 U6.1(~{CS})
nCS1: P6.4 R51.1
SCK: P6.2 R49.1 U6.6(SCK)
SI: P6.3 R48.1 U6.5(SI)
SO: P6.1 R47.1 U6.2(SO)

### Library data of the parts
C42 C43 = C-0603: SMD-0603; Price: 0.014; Value: 100n
P6 = PLS_PBD_6: Value: 2P
R47-R51 = R_SMD: Value: 22R

## Sheet fan.SchDoc
size A4; SheetNumber: 7; SheetTotal: 14
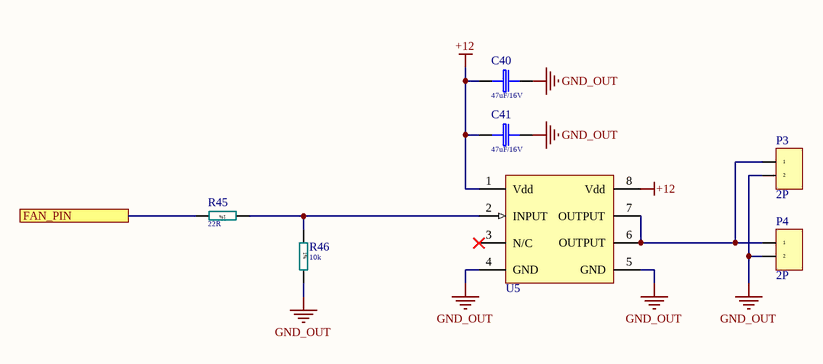
[diagram p8: fan.SchDoc]

### Parts
C40  47uF/16V  [EL Case C (6032-28)]
C41  47uF/16V  [EL Case C (6032-28)]
P3  2P  [CON: WF-02]
P4  2P  [CON: WF-02]
R45  22R  [R0603-1%]
R46  10k  [R0603-1%]
U5  TC4420  [8-SOIC]  (value not drawn)

### Ports
FAN_PIN

### Nets
+12: C40.1(+) C41.1(+) U5.1(Vdd) U5.8(Vdd)  [project net FB_+12]
GND_OUT: C40.2(-) C41.2(-) P3.2 P4.2 R46.2 U5.4(GND) U5.5(GND)
PB15: R45.2 ; port FAN_PIN
NetP3_1: P3.1 P4.1 U5.6(OUTPUT) U5.7(OUTPUT)
NetR45_1: R45.1 R46.1 U5.2(INPUT)

Not connected (* = marked no-connect by the designer): U5 3(N/C)*

### Notes on the sheet
- (in symbol R-0603-1%) 1%

### Library data of the parts
C40 C41 = EL Case C (6032-28): EL Tantalum Case C (6032-28); Price: 0.41; Value: 47uF/16V
R45 R46 = R-0603-1%: SMD 0603 0.0625W 1% 50V; Price: 0.017
  R45: Value: 22R
  R46: Value: 10k
P3 P4 = 2P: Value: 2P

## Sheet relay_bridge.SchDoc
size A4; SheetNumber: 5; SheetTotal: 14
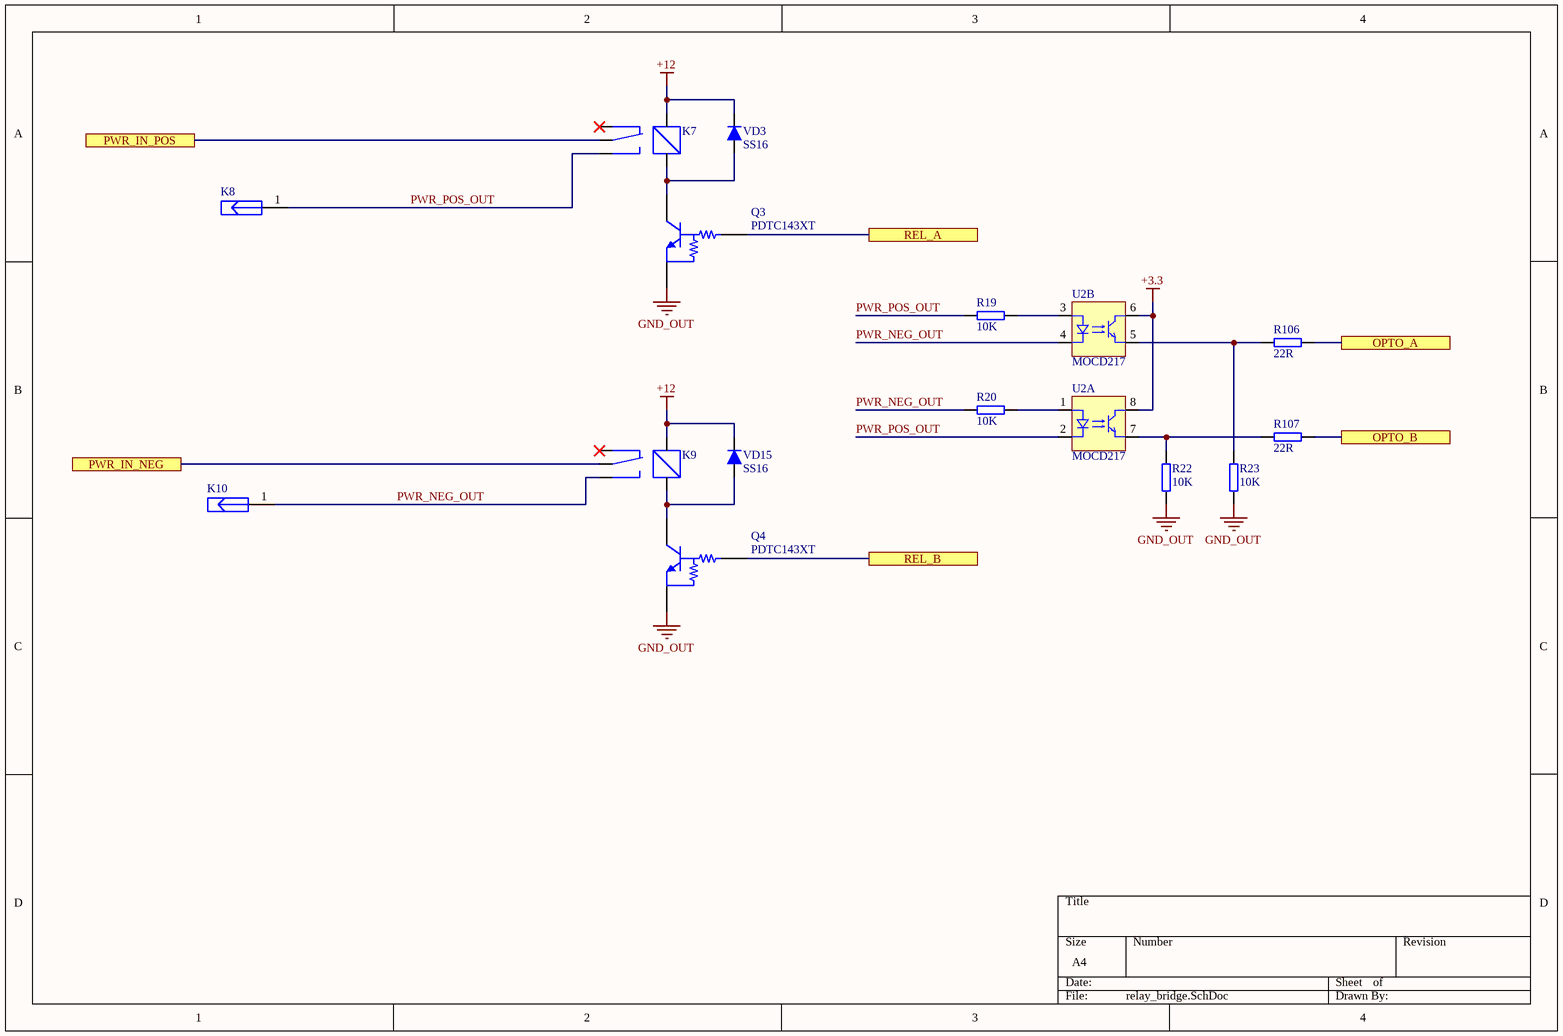
[diagram p9: relay_bridge.SchDoc]

### Parts
K7  (no value)  [REL: SRD-03VDC]
K8  (no value)  [CON: 8191]
K9  (no value)  [REL: SRD-03VDC]
K10  (no value)  [CON: 8191]
Q3  PDTC143XT  [SOT23_N]
Q4  PDTC143XT  [SOT23_N]
R19  10K  [RES: 0603]
R20  10K  [RES: 0603]
R22  10K  [RES: 0603]
R23  10K  [RES: 0603]
R106  22R  [RES: 0603]
R107  22R  [RES: 0603]
U2  MOCD217  [8-SOIC]  (parts A,B of 2)
VD3  SS16  [DIODE: SMA]
VD15  SS16  [DIODE: SMA]

### Ports
OPTO_A, OPTO_B, PWR_IN_NEG, PWR_IN_POS, REL_A, REL_B

### Nets
+3.3: U2.6(C) U2.8(C)
+12: K7.1(a) K9.1(a) VD3.2(C) VD15.2(C)  [project net FB_+12]
GND_OUT: Q3.2(E) Q4.2(E) R22.2 R23.2
PA10: Q3.1(B) ; port REL_A
PA11: R107.1 ; port OPTO_B
PA12: R106.1 ; port OPTO_A
PC7: Q4.1(B) ; port REL_B
PWR_NEG_OUT: K9.5(NO) K10.1 R20.2 U2.4(K)
PWR_POS_OUT: K7.5(NO) K8.1 R19.2 U2.2(K)
TL494_CURRENT_FB: K9.3(O) ; port PWR_IN_NEG
NetC18_1: K7.3(O) ; port PWR_IN_POS
NetK7_2: K7.2(b) Q3.3(C) VD3.1(A)
NetK9_2: K9.2(b) Q4.3(C) VD15.1(A)
NetR19_1: R19.1 U2.3(A)
NetR20_1: R20.1 U2.1(A)
NetR22_1: R22.1 R107.2 U2.7(E)
NetR23_1: R23.1 R106.2 U2.5(E)

Not connected (* = marked no-connect by the designer): K7 4(NC)*; K9 4(NC)*

### Library data of the parts
K7 K9 = Relay
K8 K10 = PCB CON
Q3 Q4 = PDTC143XT: NPN Resistor-equipped Transistor; Published: 17-Sep-2003; LatestRevisionDate: 12-Dec-2006; LatestRevisionNote: IPC-7351 Footprint Added.; DatasheetVersion: 20-Apr-1999; PackageVersion: May-1999; PackageReference: SOT23; Publisher: Altium Limited; PackageDescription: 3-Pin SOT-23 Package 0.95 mm Pitch, 2.3 mm Lead Span; ComponentLink1Description: Manufacturer Link; ComponentLink1URL: http://www.semiconductors.philips.com/; ComponentLink2Description: Datasheet; ComponentLink2URL: http://www.semiconductors.philips.com/acrobat/datasheets/PDTC143X_SERIES_8.pdf
R19 R20 R22 R23 R106 R107 = R_SMD
  R19 R20 R22 R23: Value: 10K
  R106 R107: Value: 22R
VD3 VD15 = DIODE_SMD: Value: SS16
U2 = MOCD217: Value: MOCD217

## Sheet analog_tl494.SchDoc
size A4; SheetNumber: 12; SheetTotal: 14
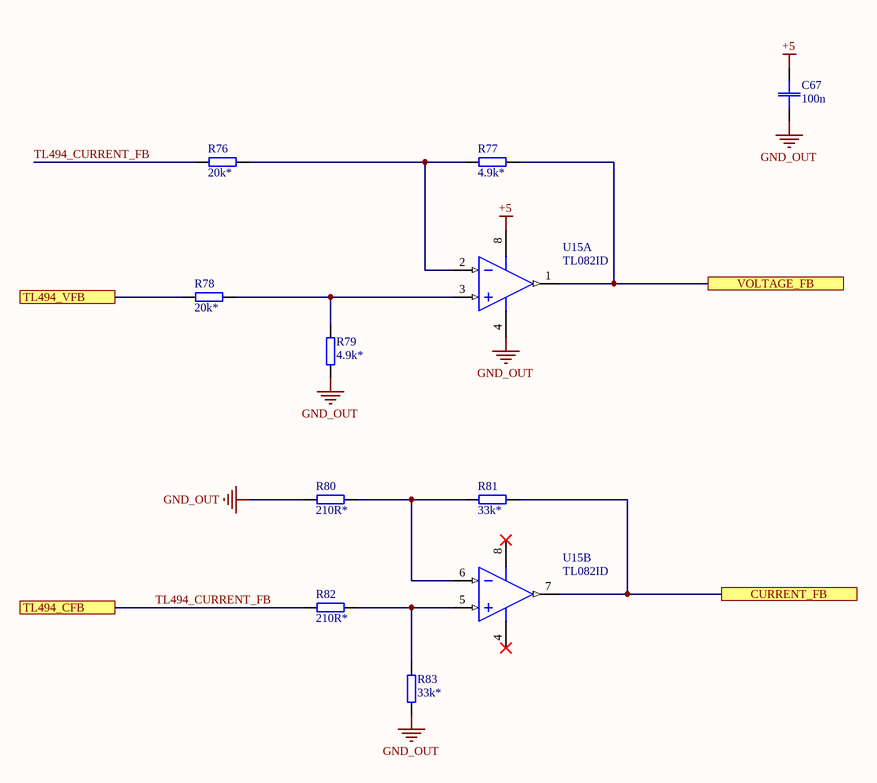
[diagram p10: analog_tl494.SchDoc]

### Parts
C67  100n  [CAP: 0603]
R76  20k*  [RES: 0603]
R77  4.9k*  [RES: 0603]
R78  20k*  [RES: 0603]
R79  4.9k*  [RES: 0603]
R80  210R*  [RES: 0603]
R81  33k*  [RES: 0603]
R82  210R*  [RES: 0603]
R83  33k*  [RES: 0603]
U15  TL082ID  [TI-D8_N]  (parts A,B of 2)

### Ports
CURRENT_FB, TL494_CFB, TL494_VFB, VOLTAGE_FB

### Nets
+5: C67.2 U15.8(VCC+)  [project net FB_+5]
GND_OUT: C67.1 R79.2 R80.1 R83.1 U15.4(VCC-)
TL494_CURRENT_FB: R76.1 R82.1 ; port TL494_CFB
NetC18_1: R78.1 ; port TL494_VFB
NetR76_2: R76.2 R77.1 U15.2(IN1-)
NetR77_2: R77.2 U15.1(OUT1) ; port VOLTAGE_FB
NetR78_2: R78.2 R79.1 U15.3(IN1+)
NetR80_2: R80.2 R81.1 U15.6(IN2-)
NetR81_2: R81.2 U15.7(OUT2) ; port CURRENT_FB
NetR82_2: R82.2 R83.2 U15.5(IN2+)

### Library data of the parts
C67 = C_SMD: Value: 100n
R76-R83 = R_SMD
  R76 R78: Value: 20k*
  R77 R79: Value: 4.9k*
  R80 R82: Value: 210R*
  R81 R83: Value: 33k*
U15 = TL082ID: JFET-Input Operational Amplifier, 7 to 36 V, -40 to 85 degC, 8-pin SOIC (D8), Green (RoHS & no Sb/Br); Manufacturer: Texas Instruments; CMRR(Min)(dB): 75; GBW(Typ)(MHz): 3; IIB(Max)(pA): 200; Iq per channel(Max)(mA): 2.8; Number of Channels: 2; Offset Drift(Typ)(uV/C): 18; Rating: Catalog; Slew Rate(Typ)(V/us): 13; Sub Family: General Purpose Amplifier, High Supply Voltage Amplifier (>=30V); Total Supply Voltage(Max)(+5V is 5, +/-5V is 10): 36; Total Supply Voltage(Min)(+5V is 5, +/-5V is 10): 7; Vio (25C)(Max)(mV): 6; DatasheetVersion: SLOS081G; PackageVersion: 4040047-3/M, 06/2011; PackageReference: D8; PackageDescription: 8-Pin Plastic Small Outline, Body 4.9 x 3.9 mm, Pitch 1.27 mm; Supplier 1: Digi-Key; Supplier Part Number 1: 296-7209-5-ND; Supplier 2: Farnell; Supplier Part Number 2: 9593403; Supplier 3: Newark; Supplier Part Number 3: 08F9350; Supplier 4: Mouser; Supplier Part Number 4: 595-TL082ID; Eco-Plan: Green (RoHS & no Sb/Br); Vn at 1kHz(Typ)(nV/rtHz): 18; Mounting Technology: Surface Mount; Code_JEDEC: MS-012; PartNumber: TL082ID; ComponentLink1Description: Manufacturer URL; ComponentLink1URL: http://www.ti.com/; ComponentLink2Description: Datasheet; ComponentLink2URL: http://www.ti.com/lit/ds/symlink/tl082.pdf; ComponentLink3Description: Package Specification; ComponentLink3URL: http://www.ti.com/litv/pdf/msoi002j

## Sheet analog_mcu.SchDoc
size A4; SheetNumber: 6; SheetTotal: 14
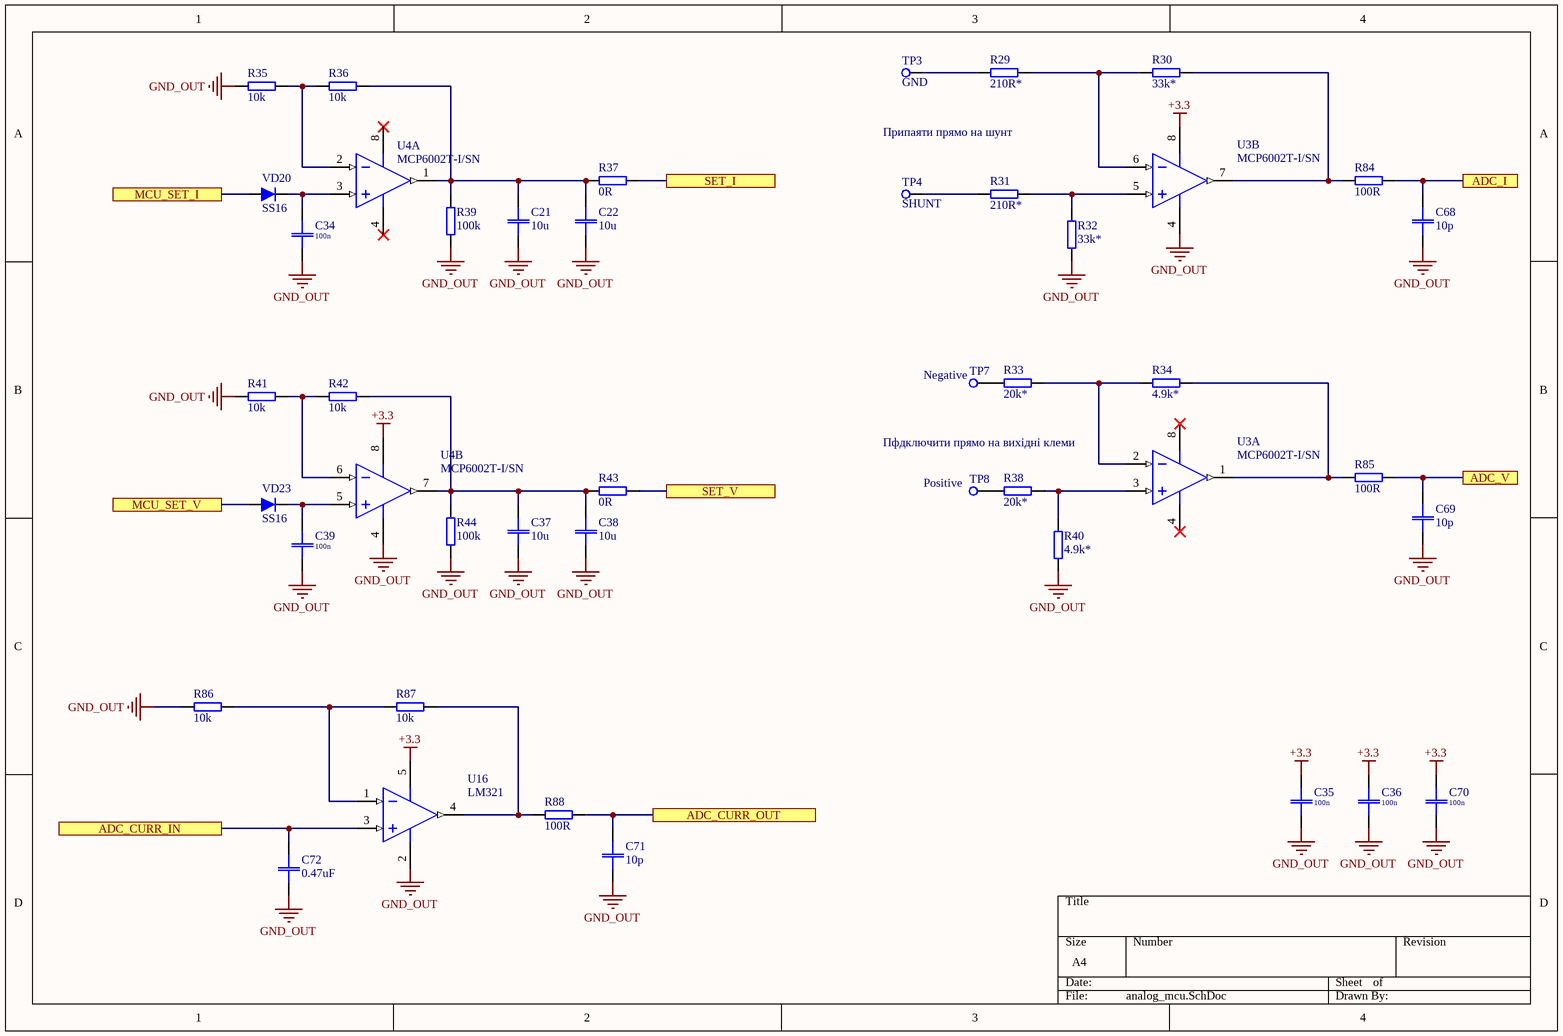
[diagram p11: analog_mcu.SchDoc]

### Parts
C21  10u  [CAP: 0805]
C22  10u  [CAP: 0805]
C34  100n  [C0603]
C35  100n  [C0603]
C36  100n  [C0603]
C37  10u  [CAP: 0805]
C38  10u  [CAP: 0805]
C39  100n  [C0603]
C68  10p  [CAP: 0603]
C69  10p  [CAP: 0603]
C70  100n  [C0603]
C71  10p  [CAP: 0603]
C72  0.47uF  [CAP: 0603]
R29  210R*  [RES: 0603]
R30  33k*  [RES: 0603]
R31  210R*  [RES: 0603]
R32  33k*  [RES: 0603]
R33  20k*  [RES: 0603]
R34  4.9k*  [RES: 0603]
R35  10k  [RES: 0603]
R36  10k  [RES: 0603]
R37  0R  [RES: 0603]
R38  20k*  [RES: 0603]
R39  100k  [RES: 0603]
R40  4.9k*  [RES: 0603]
R41  10k  [RES: 0603]
R42  10k  [RES: 0603]
R43  0R  [RES: 0603]
R44  100k  [RES: 0603]
R84  100R  [RES: 0603]
R85  100R  [RES: 0603]
R86  10k  [RES: 0603]
R87  10k  [RES: 0603]
R88  100R  [RES: 0603]
TP3  GND  [TP: TEST POINT DIP]
TP4  SHUNT  [TP: TEST POINT DIP]
TP7  Negative  [TP: TEST POINT DIP]
TP8  Positive  [TP: TEST POINT DIP]
U3  MCP6002T-I/SN  [SOIC-SN8_N]  (parts A,B of 2)
U4  MCP6002T-I/SN  [SOIC-SN8_N]  (parts A,B of 2)
U16  LM321  [SOT23-5]
VD20  SS16  [DIODE: SOD123]
VD23  SS16  [DIODE: SOD123]

### Ports
ADC_CURR_IN, ADC_CURR_OUT, ADC_I, ADC_V, MCU_SET_I, MCU_SET_V, SET_I, SET_V

### Nets
+3.3: C35.1 C36.1 C70.1 U3.8(VDD) U4.8(VDD) U16.5(V+)
GND_OUT: C21.1 C22.1 C34.1 C35.2 C36.2 C37.1 C38.1 C39.1 C68.1 C69.1 C70.2 C71.1 C72.1 R32.1 R35.1 R39.1 R40.2 R41.1 R44.1 R86.1 U3.4(VSS) U4.4(VSS) U16.2(V-)
CurrentSensOut: C72.2 U16.3(IN+) ; port ADC_CURR_IN
PA0: C69.2 R85.2 ; port ADC_V
PA1: C68.2 R84.2 ; port ADC_I
PA2: C71.2 R88.2 ; port ADC_CURR_OUT
PA6: VD20.1(A) ; port MCU_SET_I
PA7: VD23.1(A) ; port MCU_SET_V
NetC21_2: C21.2 C22.2 R36.2 R37.2 R39.2 U4.1(VOUTA)
NetC34_2: C34.2 U4.3(VINA+) VD20.2(C)
NetC37_2: C37.2 C38.2 R42.2 R43.2 R44.2 U4.7(VOUTB)
NetC39_2: C39.2 U4.5(VINB+) VD23.2(C)
NetC52_1: R37.1 ; port SET_I
NetC57_1: R43.1 ; port SET_V
NetR29_1: R29.1 TP3.1
NetR29_2: R29.2 R30.1 U3.6(VINB-)
NetR30_2: R30.2 R84.1 U3.7(VOUTB)
NetR31_1: R31.1 TP4.1
NetR31_2: R31.2 R32.2 U3.5(VINB+)
NetR33_1: R33.1 TP7.1
NetR33_2: R33.2 R34.1 U3.2(VINA-)
NetR34_2: R34.2 R85.1 U3.1(VOUTA)
NetR35_2: R35.2 R36.1 U4.2(VINA-)
NetR38_1: R38.1 TP8.1
NetR38_2: R38.2 R40.1 U3.3(VINA+)
NetR41_2: R41.2 R42.1 U4.6(VINB-)
NetR86_2: R86.2 R87.1 U16.1(IN-)
NetR87_2: R87.2 R88.1 U16.4(OUT)

### Notes on the sheet
- Припаяти прямо на шунт
- Пфдключити прямо на вихідні клеми

### Library data of the parts
C21 C22 C37 C38 C68 C69 C71 C72 = C_SMD
  C21 C22 C37 C38: Value: 10u
  C68 C69 C71: Value: 10p
  C72: Value: 0.47uF
C34-C36 C39 C70 = C-0603: SMD-0603; Price: 0.014; Value: 100n
R29-R44 R84-R88 = R_SMD
  R29 R31: Value: 210R*
  R30 R32: Value: 33k*
  R33 R38: Value: 20k*
  R34 R40: Value: 4.9k*
  R35 R36 R41 R42 R86 R87: Value: 10k
  R37 R43: Value: 0R
  R39 R44: Value: 100k
  R84 R85 R88: Value: 100R
TP3 TP4 TP7 TP8 = TEST POINT
  TP3: Value: GND
  TP4: Value: SHUNT
  TP7: Value: Negative
  TP8: Value: Positive
U3 U4 = MCP6002T-I/SN: 1 MHz, Low-Power Operational Amplifier, 8-Pin SOIC, Industrial Temperature, Tape and Reel; Published: 29-Jan-2009; DatasheetVersion: revH, May-2008; PackageVersion: revAW, Oct-2008; PackageReference: SOIC-SN8; Publisher: Altium Limited; PackageDescription: 8-Lead Plastic Small Outline (SN) - Narrow, 3.90mm Body [SOIC]; Code_JEDEC: MS-012; Code_IPC: SOIC127P600-8; ComponentLink1Description: Manufacturer Link; ComponentLink1URL: http://www.microchip.com; ComponentLink2Description: Datasheet; ComponentLink2URL: http://ww1.microchip.com/downloads/en/DeviceDoc/21733h.pdf; ComponentLink3Description: Packaging Specification; ComponentLink3URL: http://ww1.microchip.com/downloads/en/PackagingSpec/00049AW.pdf
U16 = LMV611: Value: LM321
VD20 VD23 = DIODE_SMD: Value: SS16

## Sheet rs485.SchDoc
size A4; SheetNumber: 13; SheetTotal: 14
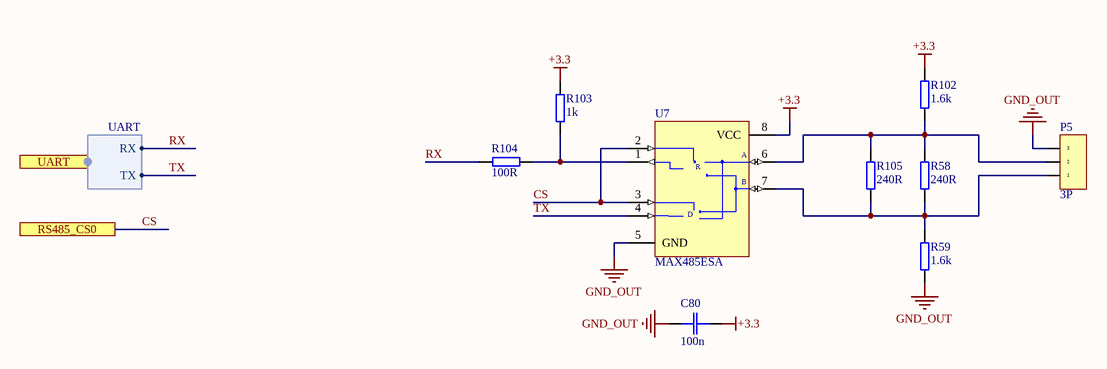
[diagram p12: rs485.SchDoc]

### Parts
C80  100n  [CAP: 0603]
P5  3P  [CON: 3P V 3.5mm]
R58  240R  [RES: 0603]
R59  1.6k  [RES: 0603]
R102  1.6k  [RES: 0603]
R103  1k  [RES: 0603]
R104  100R  [RES: 0603]
R105  240R  [RES: 0603]
U7  MAX485ESA  [NSO8_N]

### Ports
RS485_CS0, UART (harness UART)

### Harnesses
UART: RX, TX

### Nets
+3.3: C80.2 R102.1 R103.1 U7.8(VCC)
GND_OUT: C80.1 P5.3 R59.2 U7.5(GND)
CS: U7.2(~{RE}) U7.3(DE) ; port RS485_CS0
RX: R104.2 ; port UART.RX  [project net PB9]
TX: U7.4(DI) ; port UART.TX  [project net PB8]
NetP5_1: P5.1 R58.2 R59.1 R105.2 U7.7(B)
NetP5_2: P5.2 R58.1 R102.2 R105.1 U7.6(A)
NetR103_2: R103.2 R104.1 U7.1(RO)

### Notes on the sheet
- (in symbol MAX485ESA) R; D

### Library data of the parts
C80 = C_SMD: Value: 100n
R58 R59 R102-R105 = R_SMD
  R58 R105: Value: 240R
  R59 R102: Value: 1.6k
  R103: Value: 1k
  R104: Value: 100R
U7 = MAX485ESA: Low-Power, Slew-Rate-Limited RS-485/RS-422 Transceiver; Published: 16-Jan-2001; LatestRevisionDate: 13-Apr-2006; LatestRevisionNote: IPC-7351 Footprint Added.; DatasheetVersion: Feb-1996; PackageReference: NSO8; Publisher: Altium Limited; PackageDescription: 8-Pin Small Outline Integrated Circuit 1.27 mm Pitch; Code_JEDEC: MS-012-AA; Code_IPC: SOIC127P600-8; ComponentLink1Description: Manufacturer Link; ComponentLink1URL: http://www.maxim-ic.com/; ComponentLink2Description: Datasheet; ComponentLink2URL: http://pdfserv.maxim-ic.com/en/ds/MAX1487-MAX491.pdf
P5 = 3P: Value: 3P

## Sheet ds18b20.SchDoc
size A4; SheetNumber: 14; SheetTotal: 14
Used 2 times, as channels temp, temp. Parts and nets are listed once, with the designators drawn on the sheet.
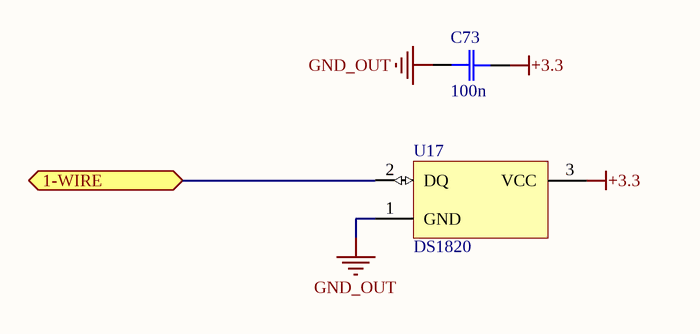
[diagram p13: ds18b20.SchDoc]

### Parts
C73  100n  [CAP: 0603]
U17  DS1820  [PR35]

### Ports
1-WIRE (bidir)

### Nets
+3.3: C73.1 U17.3(VCC)
GND_OUT: C73.2 U17.1(GND)
1-WIRE: U17.2(DQ) ; port 1-WIRE

### Channels
temp: designators end in _temp#1; ports 1-WIRE=PB6
temp: designators end in _temp#2; ports 1-WIRE=PB6

### Library data of the parts
C73 = C_SMD: Value: 100n
U17 = DS1820: 1-Wire Digital Thermometer; ComponentAvailability: Obsolete; Published: 13-Oct-2000; LatestRevisionDate: 17-Jul-2002; LatestRevisionNote: Re-released for DXP Platform.; DatasheetVersion: 5-Mar-1998; PackageVersion: 1999; PackageReference: PR35; Publisher: Altium Limited; PackageDescription: TO, Flat Index; 3 In-Line, Axial Leads; Body Dia. 4.6mm; Leads 0.56 x 0.51 mm (max); ComponentLink1Description: Manufacturer Link; ComponentLink1URL: http://www.maxim-ic.com/; ComponentLink2Description: Datasheet; ComponentLink2URL: http://pdfserv.maxim-ic.com/en/ds/DS1820-DS1820S.pdf; ComponentLink3Description: Discontinuation Notice; ComponentLink3URL: http://www.maxim-ic.com/qa/pdfs/non-obsolescence-letter.pdf

## Nets that join several sheets
+3.3: mcu (17 pins), pwr (C50.2 U11.2), fram (6 pins), relay_bridge (U2.6 U2.8), analog_mcu (6 pins), rs485 (C80.2 R102.1 R103.1 U7.8), temp (C73_temp#1.1 U17_temp#1.3), temp (C73_temp#2.1 U17_temp#2.3)
+24: pwr (C44.2 C47.2 U9.1 U10.1), remout_pwr (C25.1 C28.1 L4.2)
FB_+5: pwr (9 pins), analog_tl494 (C67.2 U15.8)
FB_+12: tl494_ctrl (13 pins), pwr (7 pins), fan (C40.1 C41.1 U5.1 U5.8), relay_bridge (K7.1 K9.1 VD3.2 VD15.2)
GND_HOT: input_hv (Br1.2 C8.2 C9.2), half_bridge (9 pins), remout_pwr (8 pins)
GND_OUT: mcu (20 pins), half_bridge (10 pins), tl494_ctrl (22 pins), pwr (19 pins), remout_pwr (6 pins), fram (C42.2 C43.2 P6.6 U6.4), fan (7 pins), relay_bridge (Q3.2 Q4.2 R22.2 R23.2), analog_tl494 (5 pins), analog_mcu (23 pins), rs485 (C80.1 P5.3 R59.2 U7.5), temp (C73_temp#1.2 U17_temp#1.1), temp (C73_temp#2.2 U17_temp#2.1)
VCC_HOT: input_hv (Br1.1 C8.1 C9.1), half_bridge (C13.1 C14.1 R7.1 VT1.2), remout_pwr (Q1.2 R21.1)
CLK: mcu (U8.42), fram (R49.2)
CS: mcu (U8.46), rs485 (U7.2 U7.3)
CS0: mcu (U8.40), fram (R50.2)
CS1: mcu (U8.41), fram (R51.2)
CurrentSensOut: half_bridge (R15.2 R18.1), analog_mcu (C72.2 U16.3)
MISO: mcu (U8.43), fram (R47.2)
MOSI: mcu (U8.44), fram (R48.2)
NetC18_1: half_bridge (C18.1 C19.1 C20.1 L3.2), relay_bridge (K7.3), analog_tl494 (R78.1)
NetC52_1: tl494_ctrl (C52.1 R56.2 U12.15), analog_mcu (R37.1)
NetC57_1: tl494_ctrl (C57.1 R60.2 U12.2), analog_mcu (R43.1)
NetR77_2: tl494_ctrl (U12.1), analog_tl494 (R77.2 U15.1)
NetR81_2: tl494_ctrl (U12.16), analog_tl494 (R81.2 U15.7)
PA0: mcu (U8.11), analog_mcu (C69.2 R85.2)
PA1: mcu (U8.12), analog_mcu (C68.2 R84.2)
PA2: mcu (U8.13), analog_mcu (C71.2 R88.2)
PA6: mcu (U8.17), analog_mcu (VD20.1)
PA7: mcu (U8.18), analog_mcu (VD23.1)
PA10: mcu (U8.32), relay_bridge (Q3.1)
PA11: mcu (U8.33), relay_bridge (R107.1)
PA12: mcu (U8.34), relay_bridge (R106.1)
PB6: mcu (R89.2 U8.45), temp (U17_temp#1.2), temp (U17_temp#2.2)
PB8: mcu (U8.47), rs485 (U7.4)
PB9: mcu (U8.48), rs485 (R104.2)
PB13: mcu (U8.25), tl494_ctrl (VD27.1)
PB14: mcu (U8.26), tl494_ctrl (Q7.1)
PB15: mcu (U8.27), fan (R45.2)
PC7: mcu (U8.31), relay_bridge (Q4.1)
TL494_CURRENT_FB: half_bridge (R11.1 R13.1), relay_bridge (K9.3), analog_tl494 (R76.1 R82.1)